# EAGLE design zik-pcb-base-bussed (EAGLE 6.5.0)
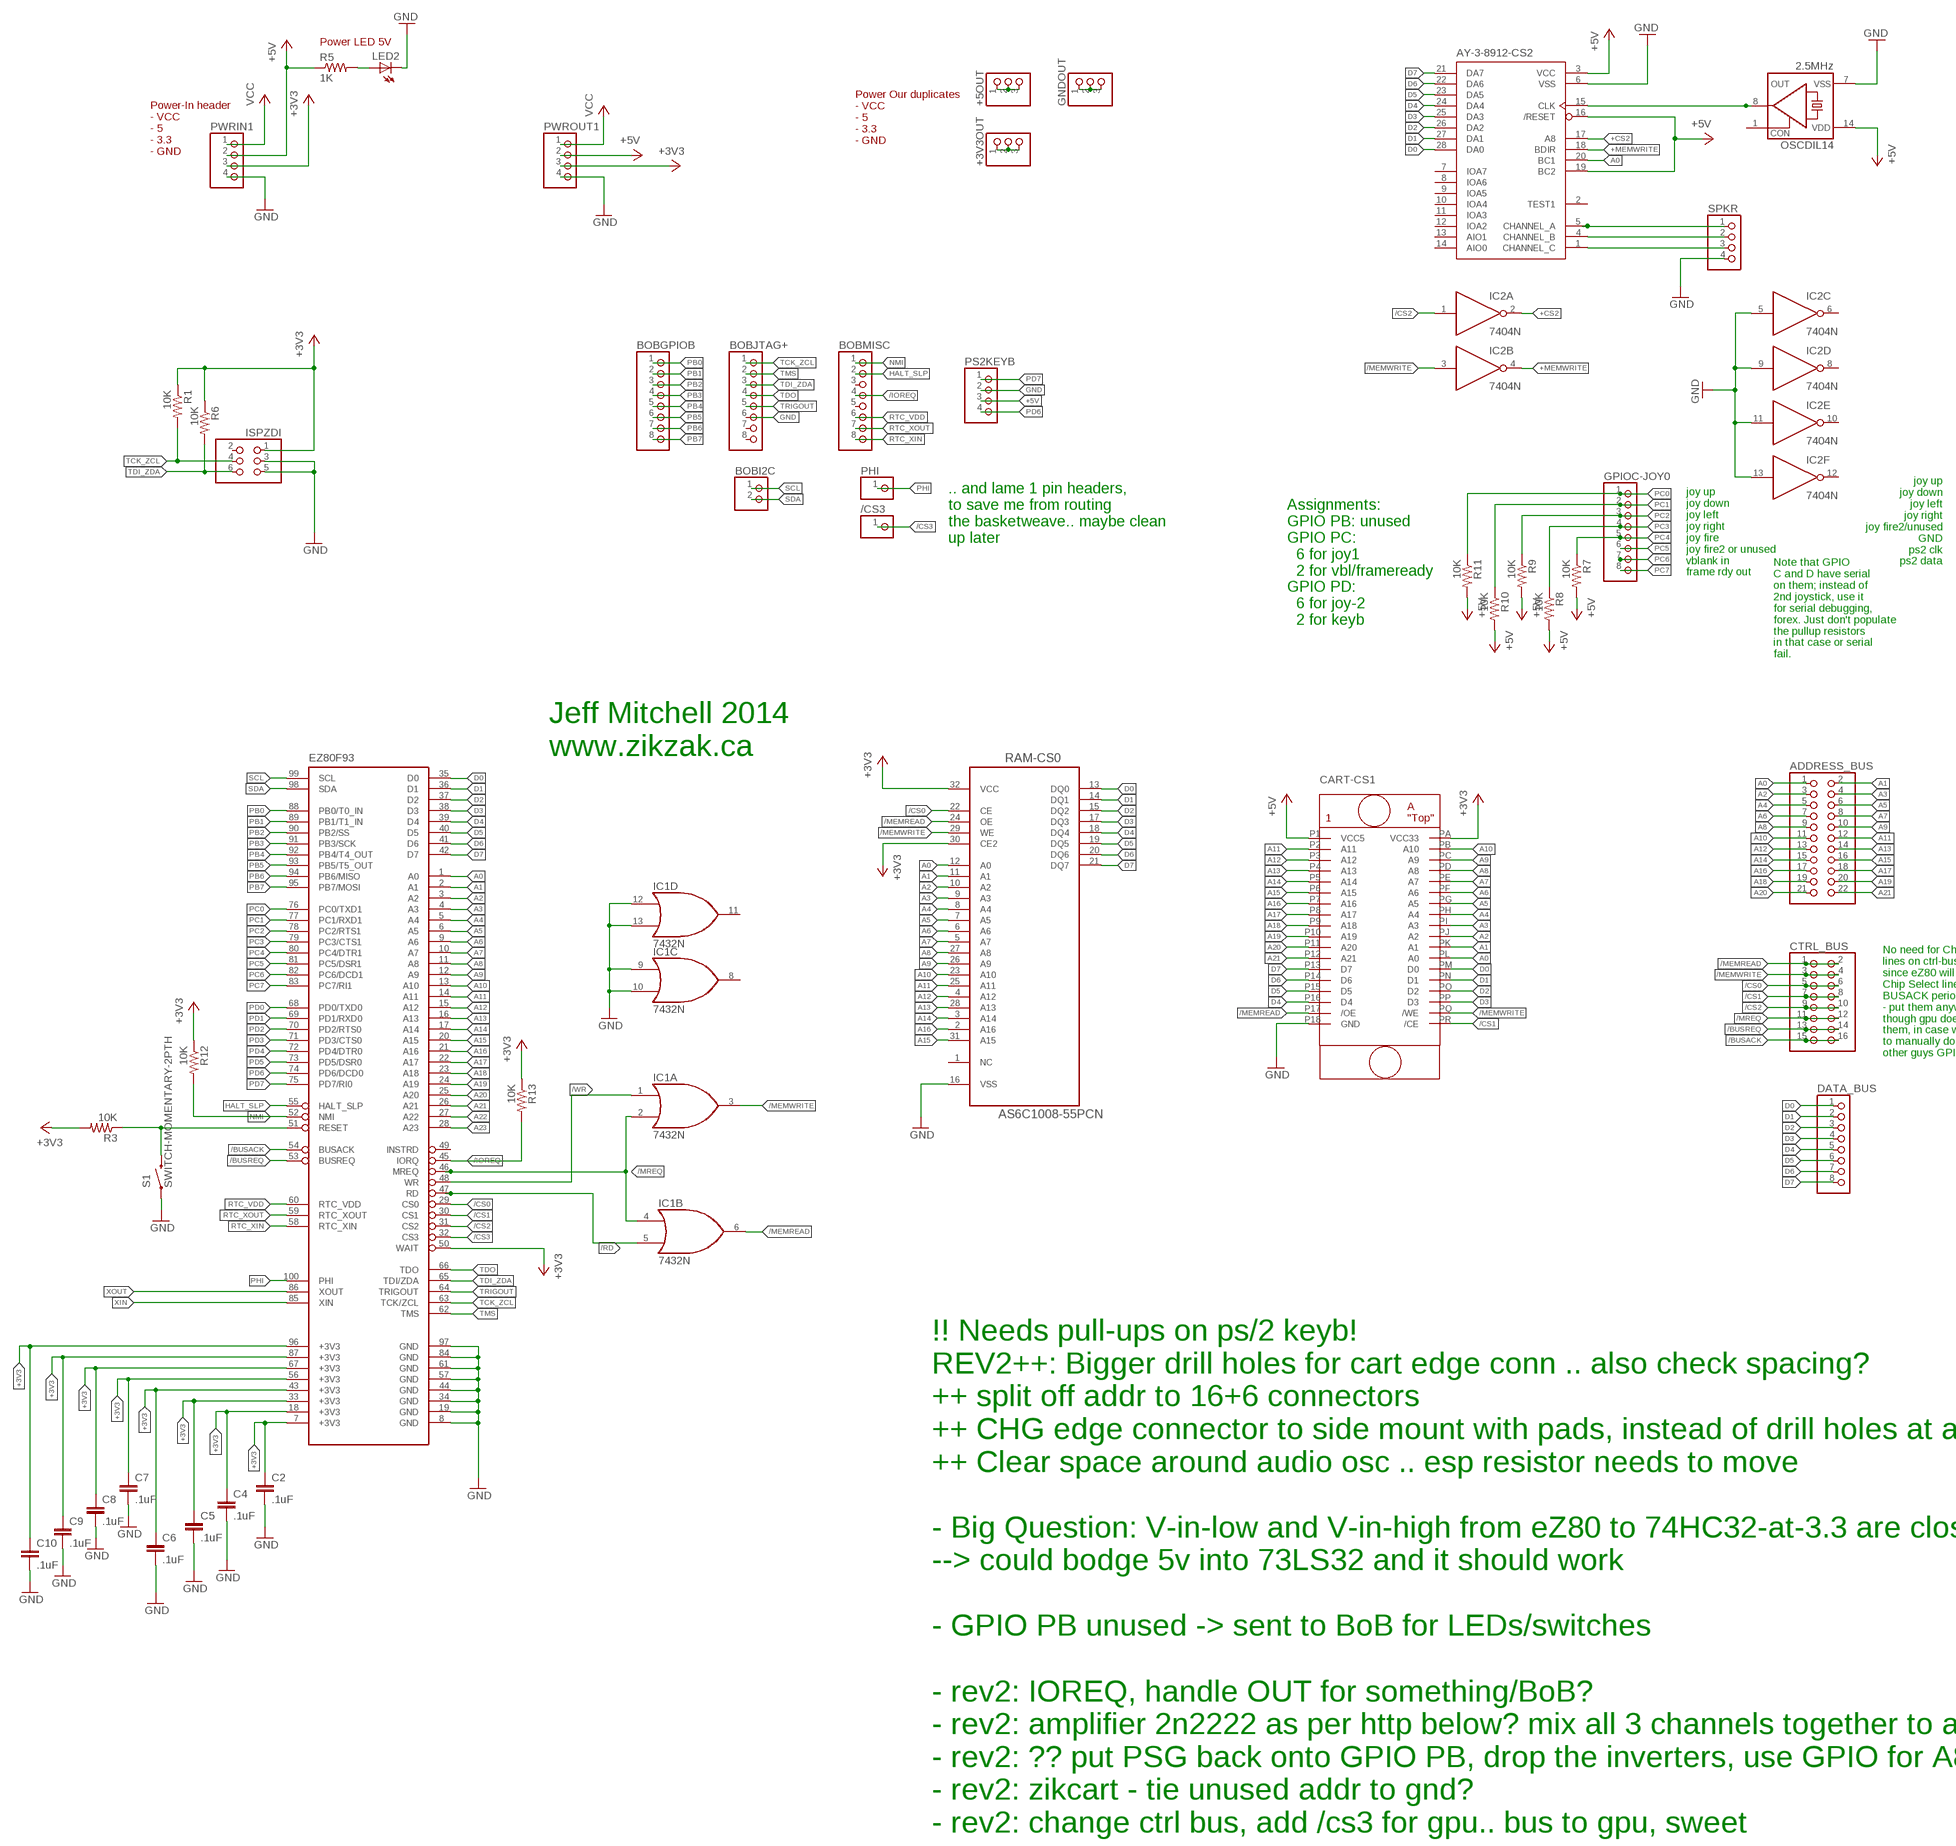
[diagram p0: schematic, sheet 1, part 1 of 2]
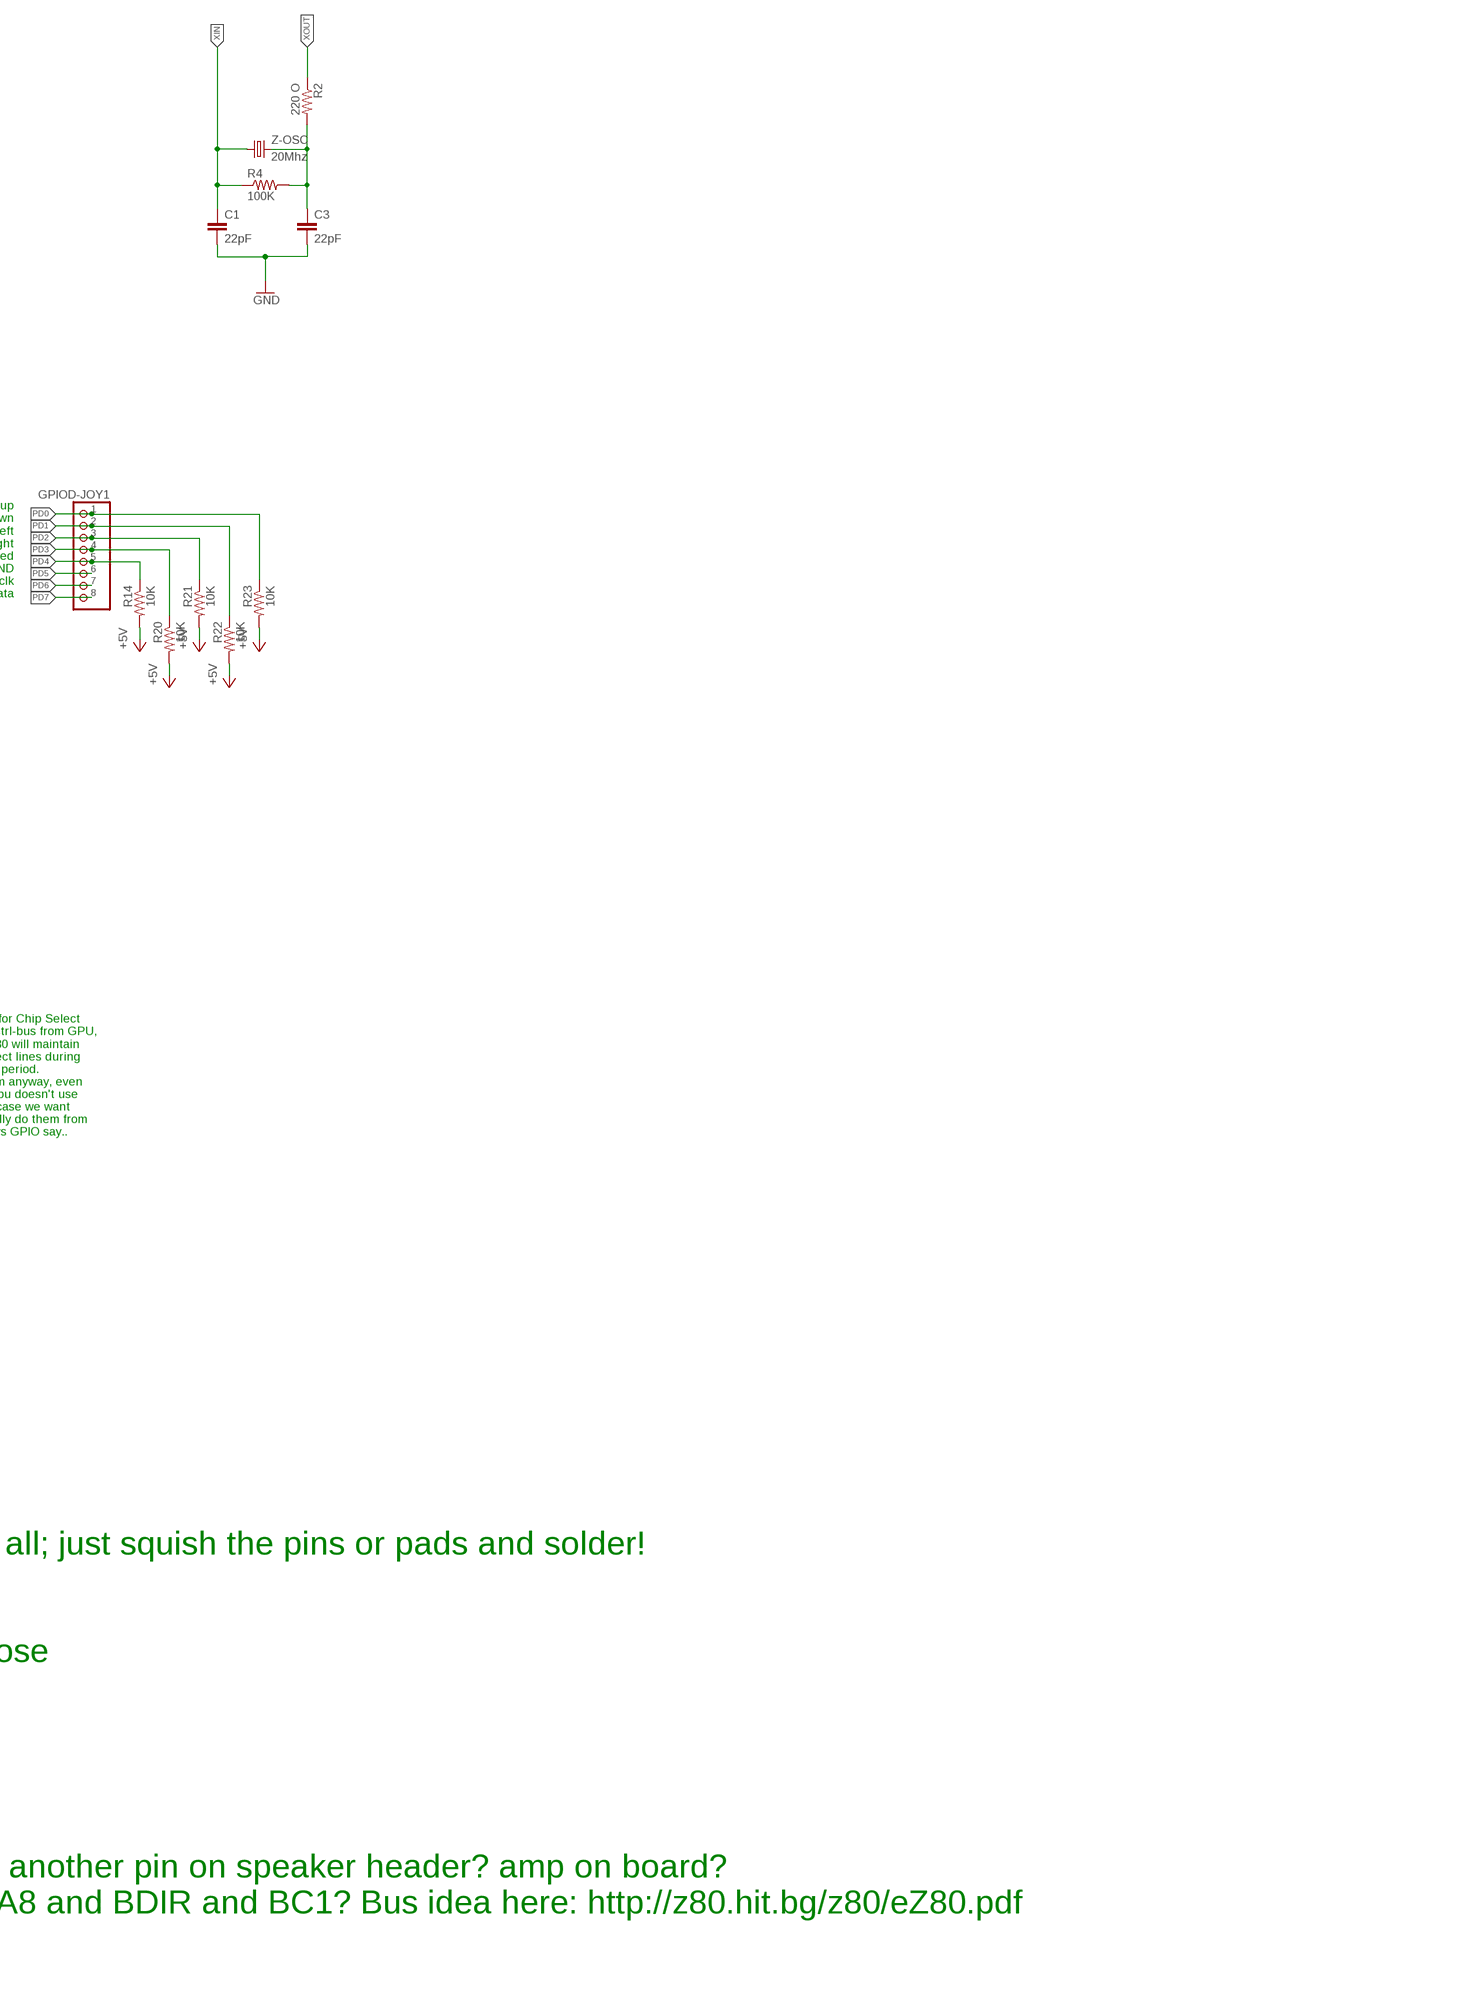
[diagram p1: schematic, sheet 1, part 2 of 2]

## Parts
+3V3OUT  PINHD-1X3  [1X03]
+5OUT  PINHD-1X3  [1X03]
/CS3  PINHD-1X1  [1X01]
ADDRESS_BUS  PINHD-2X11  [2X11]
AY-3-8912-CS2  AY-3-8912_28PIN  [DIL28]
BOBGPIOB  PINHD-1X8  [1X08]
BOBI2C  PINHD-1X2  [1X02]
BOBJTAG+  PINHD-1X8  [1X08]
BOBMISC  PINHD-1X8  [1X08]
C1  22pF  C-EU025-025X050  [C025-025X050]
C2  .1uF  C-EU025-025X050  [C025-025X050]
C3  22pF  C-EU025-025X050  [C025-025X050]
C4  .1uF  C-EU025-025X050  [C025-025X050]
C5  .1uF  C-EU025-025X050  [C025-025X050]
C6  .1uF  C-EU025-025X050  [C025-025X050]
C7  .1uF  C-EU025-025X050  [C025-025X050]
C8  .1uF  C-EU025-025X050  [C025-025X050]
C9  .1uF  C-EU025-025X050  [C025-025X050]
C10  .1uF  C-EU025-025X050  [C025-025X050]
CART-CS1  ZIKCART36  [ZIKCARTSLOT]
CTRL_BUS  PINHD-2X8  [2X08]
DATA_BUS  PINHD-1X8  [1X08]
EZ80F93  EZ80F92AZ  [SQFP-S-14X14-100]
GNDOUT  PINHD-1X3  [1X03]
GPIOC-JOY0  PINHD-1X8  [1X08]
GPIOD-JOY1  PINHD-1X8  [1X08]
IC1  7432N  [DIL14]
IC2  7404N  [DIL14]
ISPZDI  PINHD-2X3  [2X03]
LED2  LED5MM  [LED5MM]
OSCDIL14  2.5MHz  CRYSTAL_RES-SG51  [SG51]
PHI  PINHD-1X1  [1X01]
PS2KEYB  PINHD-1X4  [1X04]
PWRIN1  PINHD-1X4  [1X04]
PWROUT1  PINHD-1X4  [1X04]
R1  10K  R-US_0204/7  [0204/7]
R2  220 O  R-US_0204/7  [0204/7]
R3  10K  R-US_0204/7  [0204/7]
R4  100K  R-US_0204/7  [0204/7]
R5  1K  R-US_0207/10  [0207/10]
R6  10K  R-US_0204/7  [0204/7]
R7  10K  R-US_0204/7  [0204/7]
R8  10K  R-US_0204/7  [0204/7]
R9  10K  R-US_0204/7  [0204/7]
R10  10K  R-US_0204/7  [0204/7]
R11  10K  R-US_0204/7  [0204/7]
R12  10K  R-US_0204/7  [0204/7]
R13  10K  R-US_0204/7  [0204/7]
R14  10K  R-US_0204/7  [0204/7]
R20  10K  R-US_0204/7  [0204/7]
R21  10K  R-US_0204/7  [0204/7]
R22  10K  R-US_0204/7  [0204/7]
R23  10K  R-US_0204/7  [0204/7]
RAM-CS0  AS6C1008-55PCN  [DIP254P1524X393-32]
S1  SWITCH-MOMENTARY-2PTH  [TACTILE-PTH]
SPKR  PINHD-1X4  [1X04]
Z-OSC  20Mhz  CRYSTALHC49US  [HC49US]

## Nets
+3V3: +3V3OUT.1 +3V3OUT.2 +3V3OUT.3 C2.1 C4.1 C5.1 C6.1 C7.1 C8.1 C9.1 C10.1 CART-CS1.PA(VCC33) EZ80F93.7(+3V3) EZ80F93.18(+3V3) EZ80F93.33(+3V3) EZ80F93.43(+3V3) EZ80F93.50(WAIT) EZ80F93.56(+3V3) EZ80F93.67(+3V3) EZ80F93.87(+3V3) EZ80F93.96(+3V3) ISPZDI.1 PWRIN1.3 PWROUT1.3 R1.1 R3.2 R6.1 R12.1 R13.1 RAM-CS0.30(CE2) RAM-CS0.32(VCC)
+5V: +5OUT.1 +5OUT.2 +5OUT.3 AY-3-8912-CS2.3(VCC) AY-3-8912-CS2.16(/RESET) AY-3-8912-CS2.19(BC2) CART-CS1.P1(VCC5) OSCDIL14.14(VDD) PS2KEYB.3 PWRIN1.2 PWROUT1.2 R5.1 R7.2 R8.2 R9.2 R10.2 R11.2 R14.2 R20.2 R21.2 R22.2 R23.2
+CS2: AY-3-8912-CS2.17(A8) IC2.2(A:O)
+MEMWRITE: AY-3-8912-CS2.18(BDIR) IC2.4(B:O)
/BUSACK: CTRL_BUS.15 CTRL_BUS.16 EZ80F93.54(BUSACK)
/BUSREQ: CTRL_BUS.13 CTRL_BUS.14 EZ80F93.53(BUSREQ)
/CS0: CTRL_BUS.5 CTRL_BUS.6 EZ80F93.29(CS0) RAM-CS0.22(CE)
/CS1: CART-CS1.PR(/CE) CTRL_BUS.7 CTRL_BUS.8 EZ80F93.30(CS1)
/CS2: CTRL_BUS.9 CTRL_BUS.10 EZ80F93.31(CS2) IC2.1(A:I)
/CS3: /CS3.1 EZ80F93.32(CS3)
/IOREQ: BOBMISC.4 EZ80F93.45(IORQ) R13.2
/MEMREAD: CART-CS1.P17(/OE) CTRL_BUS.1 CTRL_BUS.2 IC1.6(B:O) RAM-CS0.24(OE)
/MEMWRITE: CART-CS1.PQ(/WE) CTRL_BUS.3 CTRL_BUS.4 IC1.3(A:O) IC2.3(B:I) RAM-CS0.29(WE)
/MREQ: CTRL_BUS.11 CTRL_BUS.12 EZ80F93.46(MREQ) IC1.2(A:I1) IC1.4(B:I0)
/RD: EZ80F93.47(RD) IC1.5(B:I1)
/WR: EZ80F93.48(WR) IC1.1(A:I0)
A0: ADDRESS_BUS.1 AY-3-8912-CS2.20(BC1) CART-CS1.PL(A0) EZ80F93.1(A0) RAM-CS0.12(A0)
A1: ADDRESS_BUS.2 CART-CS1.PK(A1) EZ80F93.2(A1) RAM-CS0.11(A1)
A2: ADDRESS_BUS.3 CART-CS1.PJ(A2) EZ80F93.3(A2) RAM-CS0.10(A2)
A3: ADDRESS_BUS.4 CART-CS1.PI(A3) EZ80F93.4(A3) RAM-CS0.9(A3)
A4: ADDRESS_BUS.5 CART-CS1.PH(A4) EZ80F93.5(A4) RAM-CS0.8(A4)
A5: ADDRESS_BUS.6 CART-CS1.PG(A5) EZ80F93.6(A5) RAM-CS0.7(A5)
A6: ADDRESS_BUS.7 CART-CS1.PF(A6) EZ80F93.9(A6) RAM-CS0.6(A6)
A7: ADDRESS_BUS.8 CART-CS1.PE(A7) EZ80F93.10(A7) RAM-CS0.5(A7)
A8: ADDRESS_BUS.9 CART-CS1.PD(A8) EZ80F93.11(A8) RAM-CS0.27(A8)
A9: ADDRESS_BUS.10 CART-CS1.PC(A9) EZ80F93.12(A9) RAM-CS0.26(A9)
A10: ADDRESS_BUS.11 CART-CS1.PB(A10) EZ80F93.13(A10) RAM-CS0.23(A10)
A11: ADDRESS_BUS.12 CART-CS1.P2(A11) EZ80F93.14(A11) RAM-CS0.25(A11)
A12: ADDRESS_BUS.13 CART-CS1.P3(A12) EZ80F93.15(A12) RAM-CS0.4(A12)
A13: ADDRESS_BUS.14 CART-CS1.P4(A13) EZ80F93.16(A13) RAM-CS0.28(A13)
A14: ADDRESS_BUS.15 CART-CS1.P5(A14) EZ80F93.17(A14) RAM-CS0.3(A14)
A15: ADDRESS_BUS.16 CART-CS1.P6(A15) EZ80F93.20(A15) RAM-CS0.31(A15)
A16: ADDRESS_BUS.17 CART-CS1.P7(A16) EZ80F93.21(A16) RAM-CS0.2(A16)
A17: ADDRESS_BUS.18 CART-CS1.P8(A17) EZ80F93.22(A17)
A18: ADDRESS_BUS.19 CART-CS1.P9(A18) EZ80F93.23(A18)
A19: ADDRESS_BUS.20 CART-CS1.P10(A19) EZ80F93.24(A19)
A20: ADDRESS_BUS.21 CART-CS1.P11(A20) EZ80F93.25(A20)
A21: ADDRESS_BUS.22 CART-CS1.P12(A21) EZ80F93.26(A21)
A22: EZ80F93.27(A22)
A23: EZ80F93.28(A23)
D0: AY-3-8912-CS2.28(DA0) CART-CS1.PM(D0) DATA_BUS.1 EZ80F93.35(D0) RAM-CS0.13(DQ0)
D1: AY-3-8912-CS2.27(DA1) CART-CS1.PN(D1) DATA_BUS.2 EZ80F93.36(D1) RAM-CS0.14(DQ1)
D2: AY-3-8912-CS2.26(DA2) CART-CS1.PO(D2) DATA_BUS.3 EZ80F93.37(D2) RAM-CS0.15(DQ2)
D3: AY-3-8912-CS2.25(DA3) CART-CS1.PP(D3) DATA_BUS.4 EZ80F93.38(D3) RAM-CS0.17(DQ3)
D4: AY-3-8912-CS2.24(DA4) CART-CS1.P16(D4) DATA_BUS.5 EZ80F93.39(D4) RAM-CS0.18(DQ4)
D5: AY-3-8912-CS2.23(DA5) CART-CS1.P15(D5) DATA_BUS.6 EZ80F93.40(D5) RAM-CS0.19(DQ5)
D6: AY-3-8912-CS2.22(DA6) CART-CS1.P14(D6) DATA_BUS.7 EZ80F93.41(D6) RAM-CS0.20(DQ6)
D7: AY-3-8912-CS2.21(DA7) CART-CS1.P13(D7) DATA_BUS.8 EZ80F93.42(D7) RAM-CS0.21(DQ7)
GND: AY-3-8912-CS2.6(VSS) C1.2 C2.2 C3.2 C4.2 C5.2 C6.2 C7.2 C8.2 C9.2 C10.2 CART-CS1.P18(GND) EZ80F93.8(GND) EZ80F93.19(GND) EZ80F93.34(GND) EZ80F93.44(GND) EZ80F93.57(GND) EZ80F93.61(GND) EZ80F93.84(GND) EZ80F93.97(GND) GNDOUT.1 GNDOUT.2 GNDOUT.3 IC1.9(C:I0) IC1.10(C:I1) IC1.12(D:I0) IC1.13(D:I1) IC2.5(C:I) IC2.9(D:I) IC2.11(E:I) IC2.13(F:I) ISPZDI.3 ISPZDI.5 LED2.K(C) OSCDIL14.7(VSS) PS2KEYB.2 PWRIN1.4 PWROUT1.4 RAM-CS0.16(VSS) S1.1 SPKR.4
HALT_SLP: BOBMISC.2 EZ80F93.55(HALT_SLP)
N$1: C3.1 R2.2 R4.2 Z-OSC.2
N$2: LED2.A R5.2
N$8: AY-3-8912-CS2.4(CHANNEL_B) SPKR.2
N$9: AY-3-8912-CS2.1(CHANNEL_C) SPKR.3
N$10: AY-3-8912-CS2.5(CHANNEL_A) SPKR.1
N$11: AY-3-8912-CS2.15(CLK) OSCDIL14.8(OUT)
NMI: BOBMISC.1 EZ80F93.52(NMI) R12.2
NRST: EZ80F93.51(RESET) R3.1 S1.3
PB0: BOBGPIOB.1 EZ80F93.88(PB0/T0_IN)
PB1: BOBGPIOB.2 EZ80F93.89(PB1/T1_IN)
PB2: BOBGPIOB.3 EZ80F93.90(PB2/SS)
PB3: BOBGPIOB.4 EZ80F93.91(PB3/SCK)
PB4: BOBGPIOB.5 EZ80F93.92(PB4/T4_OUT)
PB5: BOBGPIOB.6 EZ80F93.93(PB5/T5_OUT)
PB6: BOBGPIOB.7 EZ80F93.94(PB6/MISO)
PB7: BOBGPIOB.8 EZ80F93.95(PB7/MOSI)
PC0: EZ80F93.76(PC0/TXD1) GPIOC-JOY0.1 R11.1
PC1: EZ80F93.77(PC1/RXD1) GPIOC-JOY0.2 R10.1
PC2: EZ80F93.78(PC2/RTS1) GPIOC-JOY0.3 R9.1
PC3: EZ80F93.79(PC3/CTS1) GPIOC-JOY0.4 R8.1
PC4: EZ80F93.80(PC4/DTR1) GPIOC-JOY0.5 R7.1
PC5: EZ80F93.81(PC5/DSR1) GPIOC-JOY0.6
PC6: EZ80F93.82(PC6/DCD1) GPIOC-JOY0.7
PC7: EZ80F93.83(PC7/RI1) GPIOC-JOY0.8
PD0: EZ80F93.68(PD0/TXD0) GPIOD-JOY1.1 R23.1
PD1: EZ80F93.69(PD1/RXD0) GPIOD-JOY1.2 R22.1
PD2: EZ80F93.70(PD2/RTS0) GPIOD-JOY1.3 R21.1
PD3: EZ80F93.71(PD3/CTS0) GPIOD-JOY1.4 R20.1
PD4: EZ80F93.72(PD4/DTR0) GPIOD-JOY1.5 R14.1
PD5: EZ80F93.73(PD5/DSR0) GPIOD-JOY1.6
PD6: EZ80F93.74(PD6/DCD0) GPIOD-JOY1.7 PS2KEYB.4
PD7: EZ80F93.75(PD7/RI0) GPIOD-JOY1.8 PS2KEYB.1
PHI: EZ80F93.100(PHI) PHI.1
RTC_VDD: BOBMISC.6 EZ80F93.60(RTC_VDD)
RTC_XIN: BOBMISC.8 EZ80F93.58(RTC_XIN)
RTC_XOUT: BOBMISC.7 EZ80F93.59(RTC_XOUT)
SCL: BOBI2C.1 EZ80F93.99(SCL)
SDA: BOBI2C.2 EZ80F93.98(SDA)
TCK_ZCL: BOBJTAG+.1 EZ80F93.63(TCK/ZCL) ISPZDI.4 R1.2
TDI_ZDA: BOBJTAG+.3 EZ80F93.65(TDI/ZDA) ISPZDI.6 R6.2
TDO: BOBJTAG+.4 EZ80F93.66(TDO)
TMS: BOBJTAG+.2 EZ80F93.62(TMS)
TRIGOUT: BOBJTAG+.5 EZ80F93.64(TRIGOUT)
VCC: PWRIN1.1 PWROUT1.1
XIN: C1.1 EZ80F93.85(XIN) R4.1 Z-OSC.1
XOUT: EZ80F93.86(XOUT) R2.1
Unconnected: AY-3-8912-CS2.2(TEST1) AY-3-8912-CS2.7(IOA7) AY-3-8912-CS2.8(IOA6) AY-3-8912-CS2.9(IOA5) AY-3-8912-CS2.10(IOA4) AY-3-8912-CS2.11(IOA3) AY-3-8912-CS2.12(IOA2) AY-3-8912-CS2.13(AIO1) AY-3-8912-CS2.14(AIO0) BOBJTAG+.6 BOBJTAG+.7 BOBJTAG+.8 BOBMISC.3 BOBMISC.5 EZ80F93.49(INSTRD) IC1.8(C:O) IC1.11(D:O) IC2.6(C:O) IC2.8(D:O) IC2.10(E:O) IC2.12(F:O) ISPZDI.2 OSCDIL14.1(CON) RAM-CS0.1(NC)

## Notes on the sheet
- Power LED 5V
- Power Our duplicates
  - VCC
  - 5
  - 3.3
  - GND
- Power-In header
  - VCC
  - 5
  - 3.3
  - GND
- .. and lame 1 pin headers,
  to save me from routing
  the basketweave.. maybe clean
  up later
- joy up
  joy down
  joy left
  joy right
  joy fire2/unused
  GND
  ps2 clk
  ps2 data
- joy up
  joy down
  joy left
  joy right
  joy fire
  joy fire2 or unused
  vblank in
  frame rdy out
- Assignments:
  GPIO PB: unused
  GPIO PC:
    6 for joy1
    2 for vbl/frameready
  GPIO PD:
    6 for joy-2
    2 for keyb
- Note that GPIO
  C and D have serial
  on them; instead of
  2nd joystick, use it
  for serial debugging,
  forex. Just don't populate
  the pullup resistors
  in that case or serial
  fail.
- Jeff Mitchell 2014
  www.zikzak.ca
- No need for Chip Select
  lines on ctrl-bus from GPU,
  since eZ80 will maintain
  Chip Select lines during
  BUSACK period.
  - put them anyway, even
  though gpu doesn't use
  them, in case we want
  to manually do them from
  other guys GPIO say..
- !! Needs pull-ups on ps/2 keyb!
  REV2++: Bigger drill holes for cart edge conn .. also check spacing?
  ++ split off addr to 16+6 connectors
  ++ CHG edge connector to side mount with pads, instead of drill holes at all; just squish the pins or pads and solder!
  ++ Clear space around audio osc .. esp resistor needs to move
  
  - Big Question: V-in-low and V-in-high from eZ80 to 74HC32-at-3.3 are close
  --> could bodge 5v into 73LS32 and it should work
  
  - GPIO PB unused -> sent to BoB for LEDs/switches
  
  - rev2: IOREQ, handle OUT for something/BoB?
  - rev2: amplifier 2n2222 as per http below? mix all 3 channels together to another pin on speaker header? amp on board?
  - rev2: ?? put PSG back onto GPIO PB, drop the inverters, use GPIO for A8 and BDIR and BC1? Bus idea here: http://z80.hit.bg/z80/eZ80.pdf
  - rev2: zikcart - tie unused addr to gnd?
  - rev2: change ctrl bus, add /cs3 for gpu.. bus to gpu, sweet

## Power pins joined to a net without a drawn wire
+3V3: IC1.14(P:+3V3)
+5V: IC2.14(P:+5V)
GND: IC1.7(P:GND) IC2.7(P:GND)

## Library data of the parts
+3V3OUT +5OUT GNDOUT = pinhead:PINHD-1X3: PIN HEADER
/CS3 PHI = pinhead:PINHD-1X1: PIN HEADER
ADDRESS_BUS = pinhead:PINHD-2X11: PIN HEADER
AY-3-8912-CS2 = 8Bit_Parts:AY-3-8912_28PIN
BOBGPIOB BOBJTAG+ BOBMISC DATA_BUS GPIOC-JOY0 GPIOD-JOY1 = pinhead:PINHD-1X8: PIN HEADER
BOBI2C = pinhead:PINHD-1X2: PIN HEADER
C1-C10 = rcl:C-EU: CAPACITOR, European symbol
CART-CS1 = skeezix:ZIKCART36
CTRL_BUS = pinhead:PINHD-2X8: PIN HEADER
EZ80F93 = Zilog-eZ80-v1_0:EZ80F92: eZ80L92/F92/F93 Identical pinouts for all.
IC1 = 74xx-us-33v-skeezix:74*32: Quad 2-input OR gate
IC2 = 74xx-us-5v-skeezix:74*04: Hex INVERTER
ISPZDI = pinhead:PINHD-2X3: PIN HEADER
LED2 = SparkFun-LED:LED: LEDs Standard schematic elements and footprints for 5mm, 3mm, 1206, and 0603 sized LEDs. 5mm - Spark Fun Electronics SKU : COM-00529 (and others)
OSCDIL14 = crystal:CRYSTAL_RES-: CRYSTAL RESONATOR; OC_FARNELL: unknown; OC_NEWARK: unknown
PS2KEYB PWRIN1 PWROUT1 SPKR = pinhead:PINHD-1X4: PIN HEADER
R1-R14 R20-R23 = rcl:R-US_: RESISTOR, American symbol
RAM-CS0 = Alliance_Memory_By_element14_Batch_1:AS6C1008-55PCN: CMOS SRAM; MPN: AS6C1008-55PCN; OC_FARNELL: 1562896; OC_NEWARK: 94M6214; PACKAGE: DIP-32; SUPPLIER: ALLIANCE MEMORY
S1 = SparkFun-Electromechanical:SWITCH-MOMENTARY-2: Various NO switches- pushbuttons, reed, etc
Z-OSC = SparkFun-FreqCtrl:CRYSTAL: Various standard crystals. Proven footprints. Spark Fun Electronics SKU : COM-00534

## Net classes
1 power: width 0.254 mm

## Board
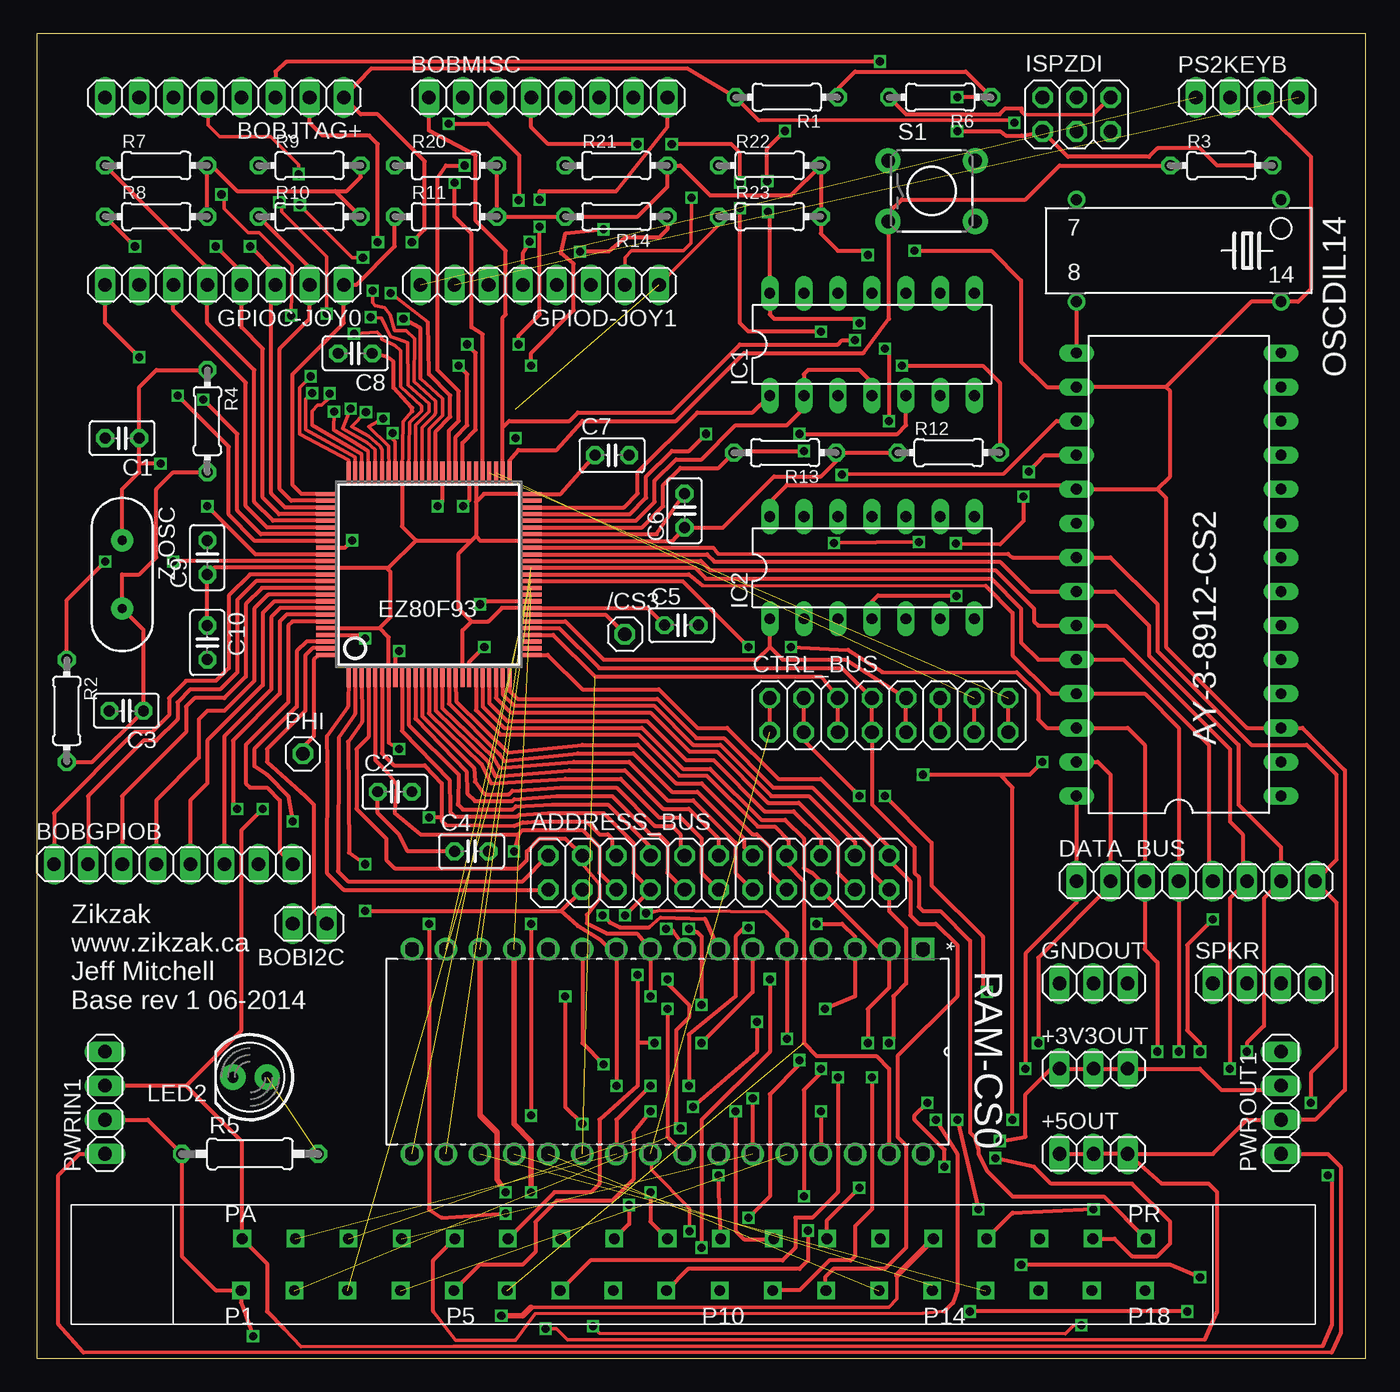
[diagram p2: board, top side]
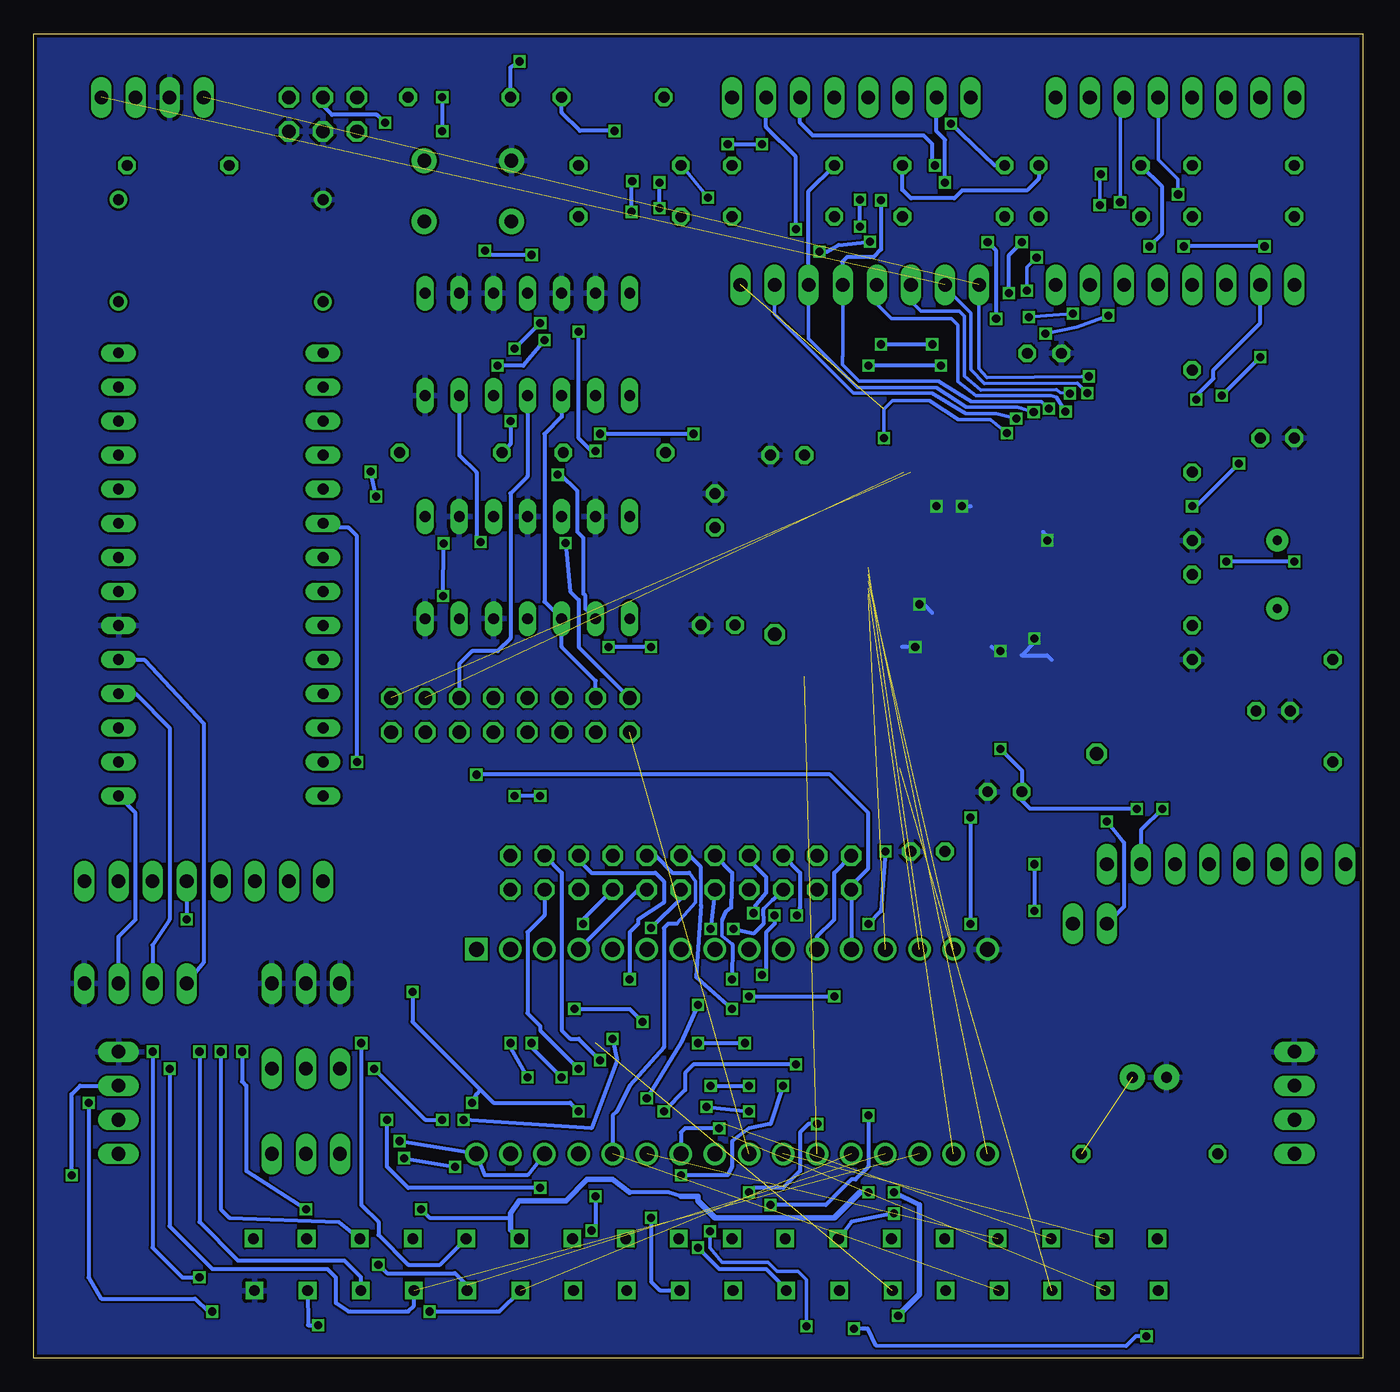
[diagram p3: board, bottom side, seen from below]

Size 99.04 x 98.73 mm. Coordinates in mm from the lower left corner, seen from the top.
Outline: 0,0 99.04,0 99.04,98.73 0,98.73 0,0
Copper layers (1*16): Top 0.035mm / dielectric 1.5mm / Bottom 0.035mm
Design rules "Elecrow_2-layer_eagle_rule": minimum track width 6mil, minimum drill 12mil, track to track 6mil, track to pad 6mil, pad to pad 6mil, via to via 6mil, smd to smd 0mil, copper to edge 10mil, drill to drill 10mil, minimum pad ring 10mil, minimum via ring 6mil, stop-mask expansion 2mil, vias tented up to drill 100mil, thermal gap 10mil

### Footprints (pad centres in the part's own frame; a part is rotated, then mirrored left to right if it is on the bottom)
1X03 = drill 1.016 long: 1 -2.54,0; 2 0,0; 3 2.54,0
1X01 = drill 1.016 octagon: 1 0,0
2X11 = drill 1.016 octagon: 1 -12.7,-1.27; 2 -12.7,1.27; 3 -10.16,-1.27; 4 -10.16,1.27; 5 -7.62,-1.27; 6 -7.62,1.27; 7 -5.08,-1.27; 8 -5.08,1.27; 9 -2.54,-1.27; 10 -2.54,1.27; 11 0,-1.27; 12 0,1.27; 13 2.54,-1.27; 14 2.54,1.27; 15 5.08,-1.27; 16 5.08,1.27; 17 7.62,-1.27; 18 7.62,1.27; 19 10.16,-1.27; 20 10.16,1.27; 21 12.7,-1.27; 22 12.7,1.27
DIL28 = drill 0.813 long: 1 -16.51,-7.62; 2 -13.97,-7.62; 3 -11.43,-7.62; 4 -8.89,-7.62; 5 -6.35,-7.62; 6 -3.81,-7.62; 7 -1.27,-7.62; 8 1.27,-7.62; 9 3.81,-7.62; 10 6.35,-7.62; 11 8.89,-7.62; 12 11.43,-7.62; 13 13.97,-7.62; 14 16.51,-7.62; 15 16.51,7.62; 16 13.97,7.62; 17 11.43,7.62; 18 8.89,7.62; 19 6.35,7.62; 20 3.81,7.62; 21 1.27,7.62; 22 -1.27,7.62; 23 -3.81,7.62; 24 -6.35,7.62; 25 -8.89,7.62; 26 -11.43,7.62; 27 -13.97,7.62; 28 -16.51,7.62
1X08 = drill 1.016 long: 1 -8.89,0; 2 -6.35,0; 3 -3.81,0; 4 -1.27,0; 5 1.27,0; 6 3.81,0; 7 6.35,0; 8 8.89,0
1X02 = drill 1.016 long: 1 -1.27,0; 2 1.27,0
C025-025X050 = drill 0.813 octagon: 1 -1.27,0; 2 1.27,0
ZIKCARTSLOT = drill 0.8 square: P1 12.675,2.515; P2 16.637,2.515; P3 20.599,2.515; P4 24.562,2.515; P5 28.524,2.515; P6 32.487,2.515; P7 36.449,2.515; P8 40.411,2.515; P9 44.374,2.515; P10 48.336,2.515; P11 52.299,2.515; P12 56.261,2.515; P13 60.223,2.515; P14 64.186,2.515; P15 68.148,2.515; P16 72.111,2.515; P17 76.073,2.515; P18 80.035,2.515; PA 12.751,6.375; PB 16.713,6.375; PC 20.676,6.375; PD 24.638,6.375; PE 28.6,6.375; PF 32.563,6.375; PG 36.525,6.375; PH 40.488,6.375; PI 44.45,6.375; PJ 48.412,6.375; PK 52.375,6.375; PL 56.337,6.375; PM 60.3,6.375; PN 64.262,6.375; PO 68.224,6.375; PP 72.187,6.375; PQ 76.149,6.375; PR 80.112,6.375
2X08 = drill 1.016 octagon: 1 -8.89,-1.27; 2 -8.89,1.27; 3 -6.35,-1.27; 4 -6.35,1.27; 5 -3.81,-1.27; 6 -3.81,1.27; 7 -1.27,-1.27; 8 -1.27,1.27; 9 1.27,-1.27; 10 1.27,1.27; 11 3.81,-1.27; 12 3.81,1.27; 13 6.35,-1.27; 14 6.35,1.27; 15 8.89,-1.27; 16 8.89,1.27
SQFP-S-14X14-100 = smd 0.3 x 1.6: 1 -6,-7.6; 2 -5.5,-7.6; 3 -5,-7.6; 4 -4.5,-7.6; 5 -4,-7.6; 6 -3.5,-7.6; 7 -3,-7.6; 8 -2.5,-7.6; 9 -2,-7.6; 10 -1.5,-7.6; 11 -1,-7.6; 12 -0.5,-7.6; 13 0,-7.6; 14 0.5,-7.6; 15 1,-7.6; 16 1.5,-7.6; 17 2,-7.6; 18 2.5,-7.6; 19 3,-7.6; 20 3.5,-7.6; 21 4,-7.6; 22 4.5,-7.6; 23 5,-7.6; 24 5.5,-7.6; 25 6,-7.6; 51 6,7.6; 52 5.5,7.6; 53 5,7.6; 54 4.5,7.6; 55 4,7.6; 56 3.5,7.6; 57 3,7.6; 58 2.5,7.6; 59 2,7.6; 60 1.5,7.6; 61 1,7.6; 62 0.5,7.6; 63 0,7.6; 64 -0.5,7.6; 65 -1,7.6; 66 -1.5,7.6; 67 -2,7.6; 68 -2.5,7.6; 69 -3,7.6; 70 -3.5,7.6; 71 -4,7.6; 72 -4.5,7.6; 73 -5,7.6; 74 -5.5,7.6; 75 -6,7.6 | smd 1.6 x 0.3: 26 7.6,-6; 27 7.6,-5.5; 28 7.6,-5; 29 7.6,-4.5; 30 7.6,-4; 31 7.6,-3.5; 32 7.6,-3; 33 7.6,-2.5; 34 7.6,-2; 35 7.6,-1.5; 36 7.6,-1; 37 7.6,-0.5; 38 7.6,0; 39 7.6,0.5; 40 7.6,1; 41 7.6,1.5; 42 7.6,2; 43 7.6,2.5; 44 7.6,3; 45 7.6,3.5; 46 7.6,4; 47 7.6,4.5; 48 7.6,5; 49 7.6,5.5; 50 7.6,6; 76 -7.6,6; 77 -7.6,5.5; 78 -7.6,5; 79 -7.6,4.5; 80 -7.6,4; 81 -7.6,3.5; 82 -7.6,3; 83 -7.6,2.5; 84 -7.6,2; 85 -7.6,1.5; 86 -7.6,1; 87 -7.6,0.5; 88 -7.6,0; 89 -7.6,-0.5; 90 -7.6,-1; 91 -7.6,-1.5; 92 -7.6,-2; 93 -7.6,-2.5; 94 -7.6,-3; 95 -7.6,-3.5; 96 -7.6,-4; 97 -7.6,-4.5; 98 -7.6,-5; 99 -7.6,-5.5; 100 -7.6,-6
DIL14 = drill 0.813 long: 1 -7.62,-3.81; 2 -5.08,-3.81; 3 -2.54,-3.81; 4 0,-3.81; 5 2.54,-3.81; 6 5.08,-3.81; 7 7.62,-3.81; 8 7.62,3.81; 9 5.08,3.81; 10 2.54,3.81; 11 0,3.81; 12 -2.54,3.81; 13 -5.08,3.81; 14 -7.62,3.81
2X03 = drill 1.016 octagon: 1 -2.54,-1.27; 2 -2.54,1.27; 3 0,-1.27; 4 0,1.27; 5 2.54,-1.27; 6 2.54,1.27
LED5MM = drill 0.813 pad 1.88: A -1.27,0; K 1.27,0
SG51 = drill 0.813: 1 -7.62,-3.81; 7 7.62,-3.81; 8 7.62,3.81; 14 -7.62,3.81
1X04 = drill 1.016 long: 1 -3.81,0; 2 -1.27,0; 3 1.27,0; 4 3.81,0
0204/7 = drill 0.813 octagon: 1 -3.81,0; 2 3.81,0
0207/10 = drill 0.813 octagon: 1 -5.08,0; 2 5.08,0
DIP254P1524X393-32 = drill 1.118 square: 1 -15.24,38.1 | drill 1.118: 2 -15.24,35.56; 3 -15.24,33.02; 4 -15.24,30.48; 5 -15.24,27.94; 6 -15.24,25.4; 7 -15.24,22.86; 8 -15.24,20.32; 9 -15.24,17.78; 10 -15.24,15.24; 11 -15.24,12.7; 12 -15.24,10.16; 13 -15.24,7.62; 14 -15.24,5.08; 15 -15.24,2.54; 16 -15.24,0; 17 0,0; 18 0,2.54; 19 0,5.08; 20 0,7.62; 21 0,10.16; 22 0,12.7; 23 0,15.24; 24 0,17.78; 25 0,20.32; 26 0,22.86; 27 0,25.4; 28 0,27.94; 29 0,30.48; 30 0,33.02; 31 0,35.56; 32 0,38.1
TACTILE-PTH = drill 1.016 pad 1.88: 1 -3.251,2.261; 2 3.251,2.261; 3 -3.251,-2.261; 4 3.251,-2.261
HC49US = drill 0.7 pad 1.651: 1 -2.54,0; 2 2.54,0

### Placement (x,y rotation side)
+3V3OUT  78.74,21.59 0 top
+5OUT  78.74,15.24 0 top
/CS3  43.81,53.98 0 top
ADDRESS_BUS  50.8,36.2 0 top
AY-3-8912-CS2  85.09,58.42 90 top
BOBGPIOB  10.16,36.83 0 top
BOBI2C  20.32,32.38 180 top
BOBJTAG+  13.97,93.98 180 top
BOBMISC  38.1,93.98 0 top
C1  6.35,68.58 180 top
C2  26.67,42.23 0 top
C3  6.67,48.26 180 top
C4  32.38,37.78 0 top
C5  48.04,54.64 0 top
C6  48.26,63.18 90 top
C7  42.86,67.31 0 top
C8  23.72,74.9 180 top
C9  12.7,59.69 90 top
C10  12.7,53.34 270 top
CART-CS1  2.54,2.54 0 top
CTRL_BUS  63.5,47.94 0 top
DATA_BUS  86.36,35.56 0 top
EZ80F93  29.21,58.42 0 top
GNDOUT  78.74,27.94 0 top
GPIOC-JOY0  13.97,80.01 180 top
GPIOD-JOY1  37.47,80.01 180 top
IC1  62.23,75.56 0 top
IC2  62.23,58.93 0 top
ISPZDI  77.47,92.71 0 top
LED2  15.88,20.95 180 top
OSCDIL14  85.09,82.55 180 top
PHI  19.81,45.05 0 top
PS2KEYB  90.17,93.98 0 top
PWRIN1  5.08,19.05 90 top
PWROUT1  92.71,19.05 90 top
R1  55.88,93.98 180 top
R2  2.22,48.26 270 top
R3  88.27,88.9 0 top
R4  12.7,69.85 270 top
R5  15.88,15.24 0 top
R6  67.31,93.98 180 top
R7  8.89,88.9 0 top
R8  8.89,85.09 0 top
R9  20.32,88.9 0 top
R10  20.32,85.09 0 top
R11  30.48,85.09 0 top
R12  67.94,67.5 0 top
R13  55.75,67.5 180 top
R14  43.18,85.09 180 top
R20  30.48,88.9 0 top
R21  43.18,88.9 0 top
R22  54.61,88.9 0 top
R23  54.61,85.09 0 top
RAM-CS0  27.94,15.24 270 top
S1  66.67,87 0 top
SPKR  91.44,27.94 0 top
Z-OSC  6.35,58.42 270 top

### Tracks (layer width: path | path; a pad name or v marks a point on that pad's centre or on a via)
+3V3  (via drill 0.6)
  Top 0.254: EZ80F93.67 27.27,69.82 27.97,70.58 | 18.41,2.22 19.68,0.86 31.05,0.89 95.82,0.92
  Top 0.305: C7.1 39.02,64.42 EZ80F93.50 33.31,64.42 32.71,63.82 | 27.97,70.58 27.97,70.83 26.57,72.33 26.57,74.26 26.13,74.61 C8.1 | EZ80F93.56 32.71,63.82 | 32.71,63.82 32.71,61.27 | 32.71,61.27 33.06,60.92 EZ80F93.43 47.35,60.92 C6.1 51.12,61.91 54.93,65.72 58.42,65.72 59.56,66.86 R13.1 R12.1 | C10.1 C9.1 13.2,58.92 EZ80F93.87 26.04,58.92 | 11.11,20.32 15.29,16.14 CART-CS1.PA 17.14,7.06 17.14,3.49 18.41,2.22 | 11.11,20.32 PWRIN1.3 | 11.11,20.32 15.24,24.45 15.24,39.37 v16.83,40.96 | 31.7,50.83 EZ80F93.18 31.71,54.25 32.38,54.93 | C4.1 27.62,37.78 26.99,39.05 25.4,40.64 C2.1 | EZ80F93.67 27.21,62.01 28.26,60.96 | 28.26,60.96 32.4,60.96 | 32.4,60.96 32.71,61.27 | 32.38,54.93 33.66,54.93 34.65,55.92 EZ80F93.33 45.49,55.92 C5.1 | 26.04,58.92 26.22,58.92 28.26,60.96 | EZ80F93.96 25.53,54.42 | 25.53,54.42 26.35,55.24 26.35,58.6 26.04,58.92 | 25.53,54.42 26.21,53.74 EZ80F93.7 26.21,45.86 v26.99,45.4 | 32.38,54.93 31.43,55.88 31.43,59.99 32.4,60.96 | R1.1 59.69,94.61 60.96,95.89 69.22,95.89 R6.1 v68.58,93.98 | v68.58,91.44 71.79,91.44 72.2,91.12 73.37,91.12 73.41,91.09 ISPZDI.1 76.83,89.53 82.87,89.53 83.5,90.17 86.68,90.17 87.95,88.9 R3.2 | PWROUT1.3 92.39,20 88.27,20 86.68,21.59 +3V3OUT.3 +3V3OUT.2 +3V3OUT.1 75.56,21.59 73.66,19.68 73.66,16.51 v71.75,16.19 | 95.82,0.92 96.52,2.54 96.52,13.34 v96.2,13.65 | v54.48,85.44 54.61,85.31 IC1.14 54.61,77.79 54.93,77.47 60.96,77.47 v61.28,77.15 | v54.42,87.72 54.42,90.14 v55.75,91.47 | v63.18,75.25 63.5,74.93 v63.5,69.85
  Bottom 0.305: v16.83,40.96 24.77,40.96 25.4,41.59 C2.1 25.4,43.81 v26.99,45.4 | v68.58,93.98 v68.58,91.44 | RAM-CS0.30 62.23,13.65 65.41,13.65 RAM-CS0.32 v71.75,16.19 | v96.2,13.65 96.2,19.68 95.57,20.32 PWROUT1.3 | v54.48,85.44 54.48,87.66 v54.42,87.72 | v55.75,91.47 58.33,91.47 59.69,92.84 R1.1 | v61.28,77.15 v63.18,75.25 | v63.5,69.85 63.5,68.14 R12.1
+5V  (via drill 0.6)
  Top 0.254: v37.91,2.22 38.7,2.22 39.53,1.4 87.03,1.4
  Top 0.305: R8.2 R7.2 13.02,88.9 14.92,87 22.23,87 | 22.23,87 R10.2 | R20.2 R11.2 R14.2 44.77,85.09 46.99,87.31 R21.2 47.94,88.9 50.16,86.68 56.2,86.68 R22.2 R23.2 58.42,83.82 59.69,82.55 61.59,82.55 v61.91,82.23 | PS2KEYB.3 91.44,93.03 94.93,89.53 94.93,79.69 93.98,78.74 OSCDIL14.14 90.49,78.74 84.14,72.39 | 84.14,72.39 AY-3-8912-CS2.16 75.25,72.39 73.34,74.3 73.34,80.33 71.12,82.55 v65.41,82.55 | 83.5,64.77 84.14,64.14 84.14,53.02 90.17,46.99 AY-3-8912-CS2.3 94.3,46.99 97.47,43.81 97.47,20 95.25,17.78 PWROUT1.2 90.17,17.78 87.63,15.24 +5OUT.3 | 83.5,64.77 AY-3-8912-CS2.19 77.15,65.09 55.88,65.09 54.61,63.82 IC2.14 | 83.5,64.77 84.45,65.72 84.45,72.07 84.14,72.39 | +5OUT.3 +5OUT.2 +5OUT.1 | PWRIN1.2 8.26,17.78 R5.1 10.79,7.62 13.34,5.08 15.19,5.08 CART-CS1.P1 15.21,4.15 v16.1,1.65 | +5OUT.3 83.82,13.02 87.31,13.02 87.95,12.38 87.95,3.49 87.03,1.4 | 22.23,87 23.08,87 24.13,88.04 R9.2
  Bottom 0.305: v61.91,82.23 65.09,82.23 v65.41,82.55 | v16.1,1.65 16.89,1.65 17.62,0.92 36.26,0.95 36.86,2.22 v37.91,2.22 | R9.2 24.13,87.92 25.02,87.03 29.84,87.03 30.42,86.45 33.66,86.45 34.29,87.09 R20.2
+CS2  (via drill 0.6)
  Top 0.305: v59.98,65.85 60.33,65.91 72.07,65.94 75.98,69.85 AY-3-8912-CS2.17
  Bottom 0.305: IC2.2 57.91,55.88 57.91,56.83 58.07,56.99 58.07,61.15 58.52,61.59 58.52,64.64 59.75,65.88 v59.98,65.85
+MEMWRITE  (via drill 0.6)
  Top 0.305: IC2.4 62.23,56.42 62.67,56.86 68.48,56.86 v68.52,56.8 | v68.48,60.74 71.79,60.67 73.53,62.42 73.53,64.2 v73.5,64.23 | v73.91,66.07 75.09,67.31 AY-3-8912-CS2.18
  Bottom 0.305: v68.52,56.8 v68.48,60.74 | v73.5,64.23 73.85,65.79 v73.91,66.07
/BUSACK  (1 unrouted)
  Top 0.305: CTRL_BUS.15 CTRL_BUS.16
/BUSREQ  (1 unrouted)
  Top 0.305: CTRL_BUS.13 CTRL_BUS.14
/CS0  (1 unrouted)
  Top 0.305: CTRL_BUS.5 CTRL_BUS.6 58.42,50.8 41.59,50.8 38.47,53.92 EZ80F93.29
/CS1
  Top 0.305: EZ80F93.30 38.92,54.42 41.91,51.44 60.01,51.44 CTRL_BUS.8 CTRL_BUS.7 62.23,41.27 65.41,38.1 65.41,36.2 65.72,35.88 65.72,33.66 66.04,33.34 67.31,33.34 69.53,31.11 69.53,16.83 69.85,16.51 70.17,15.56 70.17,15.24 70.8,13.97 72.71,12.06 79.5,12.06 CART-CS1.PR
/CS2
  Top 0.305: CTRL_BUS.9 CTRL_BUS.10 60.26,52.07 55.56,52.07 54.61,53.02 | EZ80F93.31 39.38,54.92 42.23,52.07 53.66,52.07 54.61,53.02 | 54.61,53.02 IC2.1
/CS3
  Top 0.305: EZ80F93.32 42.37,55.42 /CS3.1
/IOREQ  (via drill 0.6)
  Top 0.305: EZ80F93.45 45.09,61.92 46.67,63.5 46.67,65.09 47.94,66.36 50.8,66.36 R13.2 52.07,67.63 v57.15,67.63 | v58.42,76.52 53.02,76.52 52.39,77.15 v52.39,85.72 | v52.39,87.63 52.39,89.85 51.75,90.49 v47.31,90.49 | v44.77,90.49 38.1,90.49 36.83,91.76 BOBMISC.4
  Bottom 0.305: v57.15,67.63 57.47,67.63 58.42,68.58 v58.42,76.52 | v52.39,85.72 v52.39,87.63 | v47.31,90.49 v44.77,90.49
/MEMREAD  (via drill 0.6)  (1 unrouted)
  Top 0.254: v77.82,2.48 77.28,2.48 76.64,1.84 41.94,1.87 v41.43,2.38 | v48.64,9.46 48.64,11.18 45.78,14.03 45.78,15.18 RAM-CS0.24
  Top 0.305: CTRL_BUS.1 CTRL_BUS.2 | v65.72,60.83 v59.4,60.77
  Bottom 0.254: v41.43,2.38 41.43,5.84 42.07,6.48 43.62,6.48 44.32,7.18 47.72,7.18 48.64,8.26 v48.64,9.46
  Bottom 0.305: CART-CS1.P17 78.58,2.48 v77.82,2.48 | IC1.6 67.31,67.31 66.04,66.04 66.04,61.28 v65.72,60.83 | v59.4,60.77 59.05,57.15 58.42,56.52 58.42,53.02 CTRL_BUS.2
/MEMWRITE  (via drill 0.6)
  Top 0.305: CTRL_BUS.4 CTRL_BUS.3 57.15,46.04 v61.28,41.91 | v63.18,41.91 66.67,38.42 66.67,35.24 70.48,31.43 70.48,27.62 v70.8,27.3 | v58.42,18.41 RAM-CS0.29 | CART-CS1.PQ 80.3,8.91 81.6,7.62 83.5,7.62 84.45,8.57 84.45,10.16 81.6,13.02 75.56,13.02 74.3,14.29 v71.44,14.92 | v67.63,14.29 67.63,15.56 65.41,17.78 65.41,18.1 v66.36,19.05
  Bottom 0.305: CTRL_BUS.4 57.15,50.48 59.69,53.02 IC2.3 60.96,56.39 60.96,68.9 59.69,70.17 IC1.3 | v61.28,41.91 v63.18,41.91 | v70.8,27.3 70.8,25.08 65.72,20 | 65.72,20 64.77,19.05 59.05,19.05 v58.42,18.41 | v71.44,14.92 v67.63,14.29 | v66.36,19.05 66.04,19.68 65.72,20
/MREQ
  Top 0.305: CTRL_BUS.11 CTRL_BUS.12 | EZ80F93.46 44.64,62.42 46.04,63.82 46.04,65.41 47.62,66.99 49.53,66.99 52.07,69.53 55.88,69.53 57.15,70.8 IC1.2 57.15,73.34 57.47,73.66 61.28,73.66 62.23,72.71 IC1.4
  Bottom 0.305: IC1.4 62.23,65.72 63.5,64.45 63.5,53.66 64.45,52.7 66.36,52.7 67.31,51.75 CTRL_BUS.12
/RD  (via drill 0.6)
  Top 0.305: EZ80F93.47 44.19,62.92 45.4,64.14 45.4,65.72 47.31,67.63 48.58,67.63 v49.85,68.9 | v56.83,68.9 64.14,68.9 64.77,69.53 IC1.5
  Bottom 0.305: v49.85,68.9 v56.83,68.9
/WR
  Top 0.305: EZ80F93.48 43.73,63.42 44.77,64.45 44.77,66.04 49.21,70.48 53.34,70.48 IC1.1
A0  (via drill 0.6)
  Top 0.305: EZ80F93.1 23.18,48.58 21.59,46.35 21.62,44.42 21.59,36.2 22.86,34.92 ADDRESS_BUS.1 | v66.04,43.5 71.75,43.5 | 71.75,43.5 73.98,43.5 v74.93,44.45 | CART-CS1.PL 58.88,10.3 v61.28,12.7 | v72.71,17.78 72.71,42.55 71.75,43.5
  Bottom 0.305: RAM-CS0.12 ADDRESS_BUS.1 38.1,35.24 36.83,36.51 36.83,40.64 39.69,43.5 v66.04,43.5 | v74.93,44.45 74.93,61.28 75.56,61.91 77.15,61.91 AY-3-8912-CS2.20 | v61.28,12.7 71.12,12.7 72.71,14.29 v72.71,17.78
A1  (via drill 0.6)
  Top 0.305: EZ80F93.2 23.7,48.02 22.49,46.25 22.44,36.3 23.18,35.56 36.2,35.56 ADDRESS_BUS.2 | RAM-CS0.11 40.64,23.5 v42.23,21.91 | v52.07,18.41 52.07,9.53 52.7,8.89 54.89,8.89 CART-CS1.PK
  Bottom 0.305: v42.23,21.91 49.85,21.91 50.48,21.27 50.48,20 v52.07,18.41 | RAM-CS0.11 40.64,31.43 39.37,32.7 39.37,36.2 ADDRESS_BUS.2
A2  (via drill 0.6)
  Top 0.305: EZ80F93.3 24.23,47.42 23.18,45.94 23.26,37.7 v24.45,36.83 | v24.45,33.34 39.05,33.34 | 39.05,33.34 ADDRESS_BUS.3 | 39.05,33.34 40.32,32.23 42.01,31.18 42.7,30.48 RAM-CS0.10 v43.18,20.32 | v50.8,13.65 50.8,12.38 CART-CS1.PJ
  Bottom 0.305: v24.45,36.83 v24.45,33.34 | v43.18,20.32 44.13,17.46 45.72,17.14 46.99,16.19 46.99,14.29 47.31,13.65 v50.8,13.65
A3  (via drill 0.6)
  Top 0.254: 40.64,36.83 41.91,35.34
  Top 0.305: EZ80F93.4 24.71,46.3 23.81,45.4 23.81,40.96 26.04,38.73 26.04,37.15 26.67,36.51 35.88,36.51 36.51,37.15 36.51,37.78 37.47,38.73 39.37,38.73 ADDRESS_BUS.4 40.64,36.83 | 41.91,35.34 41.91,34.29 40.99,33.05 40.99,32.45 41.05,32.38 42.48,31.66 44.7,31.66 RAM-CS0.9 v45.72,26.99 | v39.37,26.99 39.37,18.73 v40.64,17.46 | v45.72,12.38 45.72,10.19 CART-CS1.PI
  Bottom 0.305: v45.72,26.99 v39.37,26.99 | v40.64,17.46 41.27,17.46 41.91,16.83 41.91,13.97 43.18,12.7 45.4,12.7 v45.72,12.38
A4  (via drill 0.6)
  Top 0.305: EZ80F93.5 25.21,44.59 26.11,43.69 26.8,42.74 26.67,40.64 28.57,39.05 35.88,39.05 | 35.88,39.05 36.2,39.37 40.64,39.37 41.91,38.1 41.91,36.2 ADDRESS_BUS.5 | RAM-CS0.8 48.26,30.7 47.4,31.84 v46.9,32 | 35.88,39.05 v35.56,37.78 | v36.83,32.38 v36.83,18.1 | v44.13,11.43 44.13,10.02 CART-CS1.PH
  Bottom 0.254: 44.64,33.5 43.94,34.2
  Bottom 0.305: v46.9,32 45.34,31.69 44.61,32.42 44.64,33.5 | 43.94,34.2 43.91,34.2 ADDRESS_BUS.5 | v35.56,37.78 35.88,33.34 v36.83,32.38 | v36.83,18.1 36.83,14.29 37.78,13.34 38.1,13.34 40.01,11.43 v44.13,11.43
A5  (via drill 0.6)
  Top 0.254: 45.62,32.13 46.48,32.86
  Top 0.305: EZ80F93.6 25.71,45.09 26.61,44.2 28.89,44.2 30.16,42.86 30.16,40.32 | 30.16,40.32 30.16,40.07 30.48,39.75 35.56,39.69 36.2,39.94 36.58,39.94 37.15,40.01 40.96,40.01 41.91,39.05 42.55,39.05 42.86,38.73 42.86,37.78 ADDRESS_BUS.6 | v42.16,33.02 42.7,32.48 43.47,32.13 45.62,32.13 | 46.48,32.86 49.78,32.77 RAM-CS0.7 | 30.16,40.32 v29.21,40.32 | v29.21,32.38 29.21,11.11 30.16,10.48 v34.92,10.79
  Bottom 0.305: ADDRESS_BUS.6 41.91,36.2 41.94,33.59 v42.16,33.02 | v29.21,40.32 v29.21,32.38 | v34.92,10.79 38.1,10.16 CART-CS1.PG
A6  (via drill 0.6)
  Top 0.305: EZ80F93.9 27.21,46.77 30.73,43.12 30.8,40.96 30.8,40.7 31.11,40.39 35.81,40.39 35.94,40.51 38.1,40.64 42.23,40.64 44.45,38.42 44.45,36.2 ADDRESS_BUS.7 v43.81,33.02 | v44.77,28.57 44.77,23.5 | 44.77,23.5 44.77,20.32 41.91,17.78 41.91,13.02 41.27,12.38 38.57,12.38 CART-CS1.PF | RAM-CS0.6 53.34,27.3 v49.53,23.5 | v46.04,23.5 44.77,23.5
  Bottom 0.305: v43.81,33.02 43.81,32.38 44.45,31.75 44.45,28.89 v44.77,28.57 | v49.53,23.5 v46.04,23.5
A7  (via drill 0.6)
  Top 0.254: 45.91,33.27 46.39,33.4 54.32,33.27 | 67.63,3.49 66.04,3.37 37.12,3.33 35.66,1.36 31.21,1.36 29.53,3.49
  Top 0.305: EZ80F93.10 27.71,47.22 31.43,43.5 31.37,41.34 31.37,41.27 31.75,40.89 35.43,40.89 35.69,41.15 38.42,41.27 42.55,41.27 45.72,38.1 ADDRESS_BUS.8 | v45.4,33.18 45.91,33.27 | 54.32,33.27 54.36,33.24 54.61,33.02 55.88,31.75 RAM-CS0.5 v55.88,23.81 | v66.99,17.78 68.58,15.24 68.58,5.08 68.26,4.13 67.63,3.49 | 29.53,3.49 29.53,7.3 CART-CS1.PE
  Bottom 0.305: ADDRESS_BUS.8 45.72,37.15 44.45,35.88 44.45,34.7 45.24,33.75 v45.4,33.18 | v55.88,23.81 55.56,22.23 57.47,17.14 v66.99,17.78
A8  (via drill 0.6)  (1 unrouted)
  Top 0.305: EZ80F93.11 28.21,47.67 32,43.75 32.07,42.1 32.64,41.53 35.43,41.53 35.56,41.66 38.73,41.91 42.86,41.91 45.72,39.05 46.35,39.05 46.99,38.42 46.99,36.2 ADDRESS_BUS.9 | v48.58,32 49.21,31.75 49.53,31.43 v49.53,26.35 | v53.34,19.37 RAM-CS0.27
  Bottom 0.305: ADDRESS_BUS.9 v48.58,32 | v49.53,26.35 50.8,23.5 v53.34,19.37
A9  (via drill 0.6)  (1 unrouted)
  Top 0.305: EZ80F93.12 28.71,47.87 32.58,44.01 32.64,42.99 33.15,42.29 33.4,42.04 35.18,42.04 35.43,42.29 39.05,42.55 43.18,42.55 46.04,39.69 47.31,39.69 47.94,39.05 47.94,37.78 ADDRESS_BUS.10 | v46.99,28.26 46.99,27.94 48.58,26.35 48.58,25.4 47.62,24.45 47.62,17.46 v47.94,17.14
  Bottom 0.254: 47.72,32.67 47.72,31.5 46.96,30.86
  Bottom 0.305: ADDRESS_BUS.10 46.99,36.2 47.05,33.59 47.47,33.27 47.72,32.67 | 46.96,30.86 v46.99,28.26 | v47.94,17.14 50.48,17.14 50.8,16.83 RAM-CS0.26
A10  (via drill 0.6)  (1 unrouted)
  Top 0.305: EZ80F93.13 29.21,48.07 33.15,44.26 33.85,42.86 39.37,43.18 43.5,43.18 46.35,40.32 47.94,40.32 49.53,38.73 49.53,36.2 ADDRESS_BUS.11 | v53.02,32.07 52.7,32.07 52.07,31.43 52.07,26.99 48.58,24.13 v48.58,20.32 | v45.72,20.32 43.18,17.78 RAM-CS0.23
  Bottom 0.305: ADDRESS_BUS.11 50.8,34.29 v53.02,32.07 | v48.58,20.32 v45.72,20.32
A11  (via drill 0.6)  (1 unrouted)
  Top 0.305: EZ80F93.14 29.71,48.27 33.59,44.51 34.16,43.37 39.69,43.81 43.81,43.81 46.67,40.96 48.58,40.96 50.8,38.73 ADDRESS_BUS.12 | v46.99,26.04 46.99,16.51 RAM-CS0.25
  Bottom 0.254: 49.31,35.78 49.31,33.78
  Bottom 0.305: ADDRESS_BUS.12 50.16,37.47 49.31,36.61 49.31,35.78 | 49.31,33.78 49.66,28.42 v46.99,26.04
A12  (1 unrouted)
  Top 0.305: EZ80F93.15 30.21,48.47 34.04,44.77 34.48,44.01 40.01,44.45 44.13,44.45 46.99,41.59 48.9,41.59 52.07,38.42 52.07,36.2 ADDRESS_BUS.13
  Bottom 0.305: ADDRESS_BUS.13 53.98,34.92 RAM-CS0.4
A13  (1 unrouted)
  Top 0.305: EZ80F93.16 30.71,48.79 34.48,45.02 34.8,44.51 40.32,45.09 44.45,45.09 47.31,42.23 49.21,42.23 52.7,38.73 52.7,38.1 ADDRESS_BUS.14
  Bottom 0.254: 50.16,36.2 49.72,35.56 49.72,33.97 51.12,32.38
  Bottom 0.305: ADDRESS_BUS.14 52.7,37.47 51.44,36.2 50.16,36.2 | 51.12,32.38 51.75,32.38 52.07,32.07 52.07,23.18 54.61,20.32 55.56,18.41 55.88,18.1 RAM-CS0.28
A14  (via drill 0.6)
  Top 0.305: EZ80F93.17 31.21,50.39 31.24,48.96 35.12,45.15 40.64,45.72 44.77,45.72 47.62,42.86 49.53,42.86 53.34,39.05 53.66,39.05 54.61,38.1 54.61,36.2 ADDRESS_BUS.15 | v58.1,32.38 60.01,32.38 60.96,31.43 RAM-CS0.3 60.96,26.99 v58.74,26.04 | v53.66,25.08 53.66,22.86 v48.9,18.73 | v45.72,18.41 44.45,16.83 44.45,13.34 42.86,11.75 38.73,11.75 37.15,10.16 37.15,7.94 36.2,6.99 32.99,6.99 CART-CS1.P5
  Bottom 0.305: v58.1,32.38 58.1,32.7 ADDRESS_BUS.15 | v58.74,26.04 54.61,26.04 v53.66,25.08 | v48.9,18.73 v45.72,18.41
A15  (1 unrouted)
  Top 0.305: EZ80F93.20 32.71,48.32 34.54,46.48 44.83,46.48 47.88,43.43 49.91,43.43 53.72,39.62 54.99,39.62 56.01,38.61 56.01,37.59 ADDRESS_BUS.16 55.88,36.83 57.15,35.56 57.15,23.5 58.1,22.54 62.55,22.54 63.5,21.59 RAM-CS0.31
A16  (via drill 0.6)
  Top 0.305: EZ80F93.21 33.21,48.58 34.8,46.99 45.09,46.99 48.13,43.94 50.16,43.94 53.98,40.13 55.75,40.13 57.15,38.73 57.15,36.51 57.78,36.2 58.42,35.56 ADDRESS_BUS.17 62.87,30.48 RAM-CS0.2 63.5,27.62 61.91,26.04 v61.91,23.5 | v59.69,20.95 59.69,12.38 57.78,10.48 56.52,10.48 56.52,8.26 55.56,7.3 41.24,7.3 CART-CS1.P7
  Bottom 0.305: v61.91,23.5 61.91,23.18 v59.69,20.95
A17  (via drill 0.6)
  Top 0.305: EZ80F93.22 33.71,48.84 35.05,47.5 45.47,47.5 48.39,44.58 50.42,44.58 54.23,40.77 56.39,40.77 58.42,38.73 ADDRESS_BUS.18 | v54.61,28.26 54.61,22.86 49.53,17.78 v49.53,8.26
  Bottom 0.305: ADDRESS_BUS.18 58.42,37.15 57.47,36.2 52.7,36.2 52.07,35.56 52.07,33.97 53.98,32.7 53.98,32.38 54.61,31.75 v54.61,28.26 | v49.53,8.26 47.94,6.67 44.45,6.67 42.95,5.17 CART-CS1.P8
A18  (via drill 0.6)
  Top 0.305: EZ80F93.23 34.21,49.23 35.31,48.13 45.72,48.13 48.64,45.21 50.67,45.21 54.48,41.4 56.77,41.4 59.69,38.48 59.69,36.2 ADDRESS_BUS.19 | v58.42,21.59 58.42,21.27 57.15,20 v57.15,12.06 | v57.47,9.53 57.47,7.3 56.83,6.67 48.53,6.67 CART-CS1.P9
  Bottom 0.305: ADDRESS_BUS.19 60.96,33.02 62.23,31.75 62.23,25.72 61.28,24.77 61.28,24.45 v58.42,21.59 | v57.15,12.06 57.15,9.84 v57.47,9.53
A19  (via drill 0.6)
  Top 0.305: EZ80F93.24 34.71,49.49 35.56,48.64 45.97,48.64 48.9,45.72 50.93,45.72 54.74,41.91 57.53,41.91 60.96,38.48 ADDRESS_BUS.20 | v56.83,22.23 56.83,21.91 54.61,19.68 54.61,12.06 v53.02,10.48
  Bottom 0.305: ADDRESS_BUS.20 59.69,36.2 59.69,24.45 59.05,23.81 58.42,23.81 v56.83,22.23 | v53.02,10.48 53.02,5.71 52.39,5.08 50.9,5.08 CART-CS1.P10
A20  (via drill 0.6)
  Top 0.305: EZ80F93.25 35.21,49.75 35.81,49.15 46.23,49.15 49.15,46.23 51.18,46.23 54.86,42.55 57.78,42.55 62.23,38.1 62.23,36.2 ADDRESS_BUS.21 63.5,33.34 64.77,32.07 64.77,27.94 63.82,26.99 63.82,23.81 v63.5,23.5 | v62.23,20.95 62.23,11.11 60.96,9.84 60.96,7.62 60.64,7.3 59.05,7.3 56.83,5.08 54.86,5.08 CART-CS1.P11
  Bottom 0.305: v63.5,23.5 63.5,23.18 v62.23,20.95
A21
  Top 0.305: EZ80F93.26 38.07,52.42 40.64,49.85 46.35,49.85 49.21,46.99 51.44,46.99 55.24,43.18 58.42,43.18 63.5,38.1 ADDRESS_BUS.22 63.5,37.15 65.09,35.56 65.09,33.02 65.72,32.38 66.99,32.38 68.58,30.8 68.58,26.99 64.14,22.54 64.14,16.51 64.77,15.88 64.77,8.26 63.18,6.67 59.37,6.67 58.74,6.03 58.74,5.12 CART-CS1.P12
D0  (via drill 0.6)  (1 unrouted)
  Top 0.305: AY-3-8912-CS2.28 DATA_BUS.1 77.47,33.97 73.66,30.16 v73.66,21.59 | v68.58,17.78 v70.17,11.11
  Top 0.406: RAM-CS0.13 35.56,17.46 36.83,16.19 v36.83,12.38
  Bottom 0.305: 50.8,12.06 51.75,12.38 54.61,12.38 | v73.66,21.59 69.85,17.78 v68.58,17.78 | v70.17,11.11 69.53,10.48 63.5,10.48
  Bottom 0.406: v36.83,12.38 37.47,12.38 39.37,10.48 48.26,10.48 49.53,11.75 49.53,12.06 50.8,12.06 | 54.61,12.38 55.88,13.34 57.78,13.34 59.37,11.75 62.87,11.75 63.5,10.79 63.5,10.48 63.5,9.58 CART-CS1.PM
D1  (via drill 0.6)  (1 unrouted)
  Top 0.254: 36.83,3.81 63.5,3.81 64.07,4.45 64.07,6.18
  Top 0.305: AY-3-8912-CS2.27 79.06,44.45 80.01,43.5 DATA_BUS.2 80.01,35.24 74.61,29.84 v74.61,23.5
  Top 0.406: RAM-CS0.14 33.02,18.1 34.29,16.83 34.29,13.34 v34.92,12.38 | v34.61,3.17 36.2,3.17 36.83,3.81 | 64.07,6.18 CART-CS1.PN
  Bottom 0.305: v74.61,23.5 74.61,11.43 73.34,10.16 73.34,9.21 71.12,6.99 68.73,6.99 CART-CS1.PN
  Bottom 0.406: v34.92,12.38 33.02,11.43 33.02,4.76 v34.61,3.17
D2  (via drill 0.6)  (1 unrouted)
  Top 0.305: EZ80F93.37 48.12,57.92 v53.02,53.02 | v56.2,53.02 60.45,52.8 62.99,51.15 73.03,51.12 74.61,49.53 74.61,47.62 75.25,46.99 AY-3-8912-CS2.26 81.28,46.99 82.55,45.72 DATA_BUS.3 82.55,30.48 83.5,29.53 v83.5,22.86 | v78.74,11.11 72.71,10.79 72.71,10.86 CART-CS1.PO
  Bottom 0.305: v53.02,53.02 v56.2,53.02 | v83.5,22.86 83.5,20.64 83.19,20.32 83.19,13.97 v78.74,11.11
D3  (via drill 0.6)  (1 unrouted)
  Top 0.254: 49.59,57.59 70.71,57.56
  Top 0.305: EZ80F93.38 48.58,58.42 49.59,57.59 | 70.71,57.56 72.71,55.56 72.71,52.39 75.56,49.53 AY-3-8912-CS2.25 82.55,49.53 85.09,46.99 DATA_BUS.4 v85.09,22.86
  Bottom 0.305: v85.09,22.86 85.09,11.11 84.45,10.48 76.29,10.16 CART-CS1.PP
D4  (via drill 0.6)  (1 unrouted)
  Top 0.305: EZ80F93.39 49.03,58.92 49.85,58.1 71.12,58.1 73.34,55.88 73.34,53.34 74.61,52.07 AY-3-8912-CS2.24 80.96,52.07 87.31,45.72 87.31,35.88 DATA_BUS.5 | v87.63,32.7 85.72,30.8 85.72,24.45 86.68,23.5 v86.68,22.86
  Bottom 0.305: DATA_BUS.5 v87.63,32.7 | v86.68,22.86 86.68,10.16 83.82,7.3 75.88,7.3 74.65,6.07 CART-CS1.P16
D5  (via drill 0.6)  (1 unrouted)
  Top 0.305: EZ80F93.40 49.48,59.42 50.16,58.74 71.44,58.74 74.3,55.88 74.3,54.93 74.61,54.61 AY-3-8912-CS2.23 79.69,54.61 88.9,45.4 88.9,40.01 89.85,39.05 89.85,35.88 DATA_BUS.6 88.9,34.29 v88.9,21.59
  Bottom 0.305: v88.9,21.59 88.9,9.84 85.72,6.67 77.15,6.67 76.52,6.03 76.52,4.13 75.56,3.49 71.12,3.49 70.69,3.92 CART-CS1.P15
D6  (via drill 0.6)  (1 unrouted)
  Top 0.305: EZ80F93.41 49.94,59.92 50.48,59.37 71.75,59.37 73.98,57.15 AY-3-8912-CS2.22 80.33,57.15 82.87,54.61 82.87,52.39 89.53,45.72 89.53,41.27 92.71,38.1 DATA_BUS.7 91.44,34.29 91.44,24.77 90.17,23.5 v90.17,22.86 | v86.68,6.03 84.45,6.99 v73.34,6.99
  Bottom 0.305: v90.17,22.86 90.17,8.26 87.95,6.03 v86.68,6.03 | v73.34,6.99 72.71,6.35 67.63,6.35 66.73,5.45 CART-CS1.P14
D7  (via drill 0.6)  (1 unrouted)
  Top 0.254: 50.77,59.94 72.36,59.94
  Top 0.305: EZ80F93.42 50.39,60.42 50.77,59.94 | 72.36,59.94 72.71,59.69 AY-3-8912-CS2.21 80.01,59.69 83.5,56.2 83.5,52.7 90.49,45.72 94.61,45.72 96.84,43.5 96.84,37.15 DATA_BUS.8 96.84,33.97 96.84,23.18 94.93,21.27 v94.93,19.05 | v85.72,3.49 v69.53,3.49
  Bottom 0.305: v94.93,19.05 94.93,6.03 93.98,4.45 87,4.45 86.04,3.49 v85.72,3.49 | v69.53,3.49 64.33,3.49 CART-CS1.P13
GND  (via drill 0.6)
  Top 0.305: EZ80F93.44 46.18,61.42 C6.2 | EZ80F93.97 24.18,53.92 v24.45,53.66 | EZ80F93.8 26.71,52.43 v26.99,52.7 | EZ80F93.19 32.21,51.9 v33.34,53.02 | EZ80F93.34 33.24,56.42 v33.02,56.2 | EZ80F93.57 32.21,63.96 v31.75,63.5 | EZ80F93.61 30.21,63.87 v29.84,63.5 | EZ80F93.84 22.95,60.42 v23.5,60.96
  Bottom 0.305: v24.45,53.66 24.45,53.34 25.4,52.39 23.5,52.39 23.18,52.07 | v26.99,52.7 27.3,52.7 27.62,53.02 | v33.34,53.02 34.29,53.02 | v33.02,56.2 32.7,56.2 32.07,55.56 | v31.75,63.5 31.75,63.82 31.43,63.5 | v29.84,63.5 29.21,63.5 | v23.5,60.96 23.5,61.28 23.81,61.59
  pour Bottom: 0,99.06 0,0 99.06,0 99.06,99.06
HALT_SLP  (via drill 0.6)
  Top 0.305: EZ80F93.55 33.21,76.33 32.38,76.83 32.38,83.82 31.11,85.09 v31.11,87.63
  Bottom 0.305: v31.11,87.63 31.11,90.81 31.75,91.44 BOBMISC.2
N$1
  Top 0.305: R4.2 10.16,66.04 8.89,64.77 8.89,59.69 7.62,58.42 6.35,58.42 Z-OSC.2 7.94,54.29 C3.1 4.13,44.45 R2.2
N$2  (1 unrouted)
N$8
  Bottom 0.305: AY-3-8912-CS2.4 91.44,49.53 88.9,46.99 88.9,32.7 90.17,30.8 SPKR.2
N$9
  Bottom 0.305: SPKR.3 92.71,31.43 91.44,32.7 91.44,40.64 AY-3-8912-CS2.1
N$10
  Bottom 0.305: AY-3-8912-CS2.5 90.81,52.07 86.36,47.31 86.36,29.53 SPKR.1
N$11
  Top 0.305: OSCDIL14.8 AY-3-8912-CS2.15
NMI  (via drill 0.6)
  Top 0.305: EZ80F93.52 34.71,69.38 | 34.71,69.38 34.71,77.57 34.92,77.79 34.92,82.55 32.7,84.77 32.7,89.66 29.21,91.5 BOBMISC.1 | 34.71,69.38 35.18,69.85 39.69,69.85 40.32,70.48 47.31,70.48 52.39,75.56 59.69,75.56 60.01,75.88 v60.96,75.88 | R12.2 71.75,72.71 70.48,73.98 v64.45,73.98
  Bottom 0.305: v60.96,75.88 62.55,73.98 v64.45,73.98
NRST
  Top 0.305: EZ80F93.51 35.21,66.9 35.88,67.69 38.73,67.69 40.64,69.85 47.62,69.85 52.7,74.93 61.59,74.93 63.5,77.47 63.5,84.66 | 63.5,84.66 S1.3 | 63.5,84.66 63.5,85.41 64.45,86.36 73.66,86.36 76.2,88.9 R3.1
PB0
  Top 0.305: EZ80F93.88 15.88,58.42 14.29,56.83 14.29,51.44 13.34,50.48 11.11,50.48 9.84,49.21 9.84,47.94 8.57,46.67 7.3,46.67 1.27,40.64 BOBGPIOB.1
PB1
  Top 0.305: EZ80F93.89 16.33,57.92 14.92,56.52 14.92,51.12 13.65,49.85 11.43,49.85 10.48,48.9 10.48,47.62 8.89,46.04 7.94,46.04 3.81,41.91 BOBGPIOB.2
PB2
  Top 0.305: EZ80F93.90 16.78,57.42 15.56,56.2 15.56,50.8 13.97,49.21 11.75,49.21 11.11,48.58 11.11,46.67 6.35,41.91 BOBGPIOB.3
PB3
  Top 0.305: EZ80F93.91 17.23,56.92 16.19,55.88 16.19,50.48 13.97,48.26 12.7,48.26 12.06,47.62 12.06,44.77 8.89,41.59 BOBGPIOB.4
PB4
  Top 0.305: EZ80F93.92 17.68,56.42 16.83,55.56 16.83,50.16 12.7,46.04 12.7,42.86 11.43,41.59 BOBGPIOB.5
PB5
  Top 0.305: EZ80F93.93 18.14,55.92 17.46,55.24 17.46,49.85 13.97,46.35 BOBGPIOB.6
PB6  (via drill 0.6)
  Top 0.305: EZ80F93.94 18.59,55.42 18.1,54.93 18.1,49.53 14.61,46.04 14.61,41.27 v14.92,40.96
  Bottom 0.305: v14.92,40.96 16.51,39.37 BOBGPIOB.7
PB7
  Top 0.305: EZ80F93.95 19.04,54.92 18.73,54.61 18.73,48.9 15.56,45.72 15.56,42.86 15.88,42.55 17.14,42.55 18.1,41.59 18.1,37.78 BOBGPIOB.8
PC0
  Top 0.305: EZ80F93.76 19.72,64.42 19.05,65.09 19.05,73.34 22.86,77.15 GPIOC-JOY0.1 23.81,80.01 26.67,82.87 R11.1
PC1
  Top 0.305: EZ80F93.77 18.95,63.92 18.1,64.77 18.1,75.25 20.32,77.47 GPIOC-JOY0.2 20.32,81.28 R10.1
PC2  (via drill 0.6)
  Top 0.305: EZ80F93.78 18.5,63.42 17.46,64.45 17.46,79.69 GPIOC-JOY0.3 17.78,80.96 v15.88,82.87
  Bottom 0.305: v15.88,82.87 14.92,83.82 14.92,87.31 R9.1
PC3  (via drill 0.6)
  Top 0.305: EZ80F93.79 18.04,62.92 16.83,64.14 16.83,75.25 15.24,76.83 GPIOC-JOY0.4 15.24,80.96 v13.34,82.87 | v7.3,82.87 R8.1
  Bottom 0.305: v7.3,82.87 v13.34,82.87
PC4
  Top 0.305: EZ80F93.80 17.59,62.42 16.19,63.82 16.19,73.66 12.7,77.15 GPIOC-JOY0.5 12.7,81.28 R7.1
PC5
  Top 0.305: EZ80F93.81 17.14,61.92 15.56,63.5 15.56,72.71 10.16,78.11 GPIOC-JOY0.6
PC6  (via drill 0.6)
  Top 0.305: EZ80F93.82 16.68,61.42 14.92,63.18 14.92,68.9 v12.38,71.44
  Bottom 0.305: v12.38,71.44 12.38,71.75 11.11,73.03 11.11,73.66 7.62,77.15 GPIOC-JOY0.7
PC7  (via drill 0.6)
  Top 0.305: EZ80F93.83 16.23,60.92 14.29,62.87 14.29,67.94 v10.48,71.75 | v7.62,74.61 5.08,77.15 GPIOC-JOY0.8
  Bottom 0.305: v10.48,71.75 v7.62,74.61
PD0  (via drill 0.6)  (1 unrouted)
  Top 0.254: GPIOD-JOY1.1 50.8,84.45 R23.1 | EZ80F93.68 26.7,68.33 26.51,68.52 v26.51,68.96
  Bottom 0.254: v26.51,68.96 27.72,69.98 30.1,69.98 32.29,71.37 35.02,71.37 35.66,70.74 v35.66,68.58
PD1  (via drill 0.6)
  Top 0.254: GPIOD-JOY1.2 43.81,82.04 44.32,82.55 48.16,82.55 48.74,83.12 v48.77,86.49 | EZ80F93.69 26.23,66.03 26.19,67.98 24.73,69.44 v25.81,70.04
  Bottom 0.254: v48.77,86.49 50.7,88.9 R22.1 | v25.81,70.04 27.27,70.39 29.56,70.42 32.1,71.94 37.94,71.94 43.81,77.82 GPIOD-JOY1.2
PD2  (via drill 0.6)
  Top 0.254: EZ80F93.70 25.72,67.72 25.56,67.98 24.7,68.74 23.46,69.44 v24.51,70.52
  Bottom 0.254: v24.51,70.52 25.72,70.9 29.53,70.9 31.75,72.36 37.66,72.36 41.27,75.98 GPIOD-JOY1.3
  Bottom 0.305: GPIOD-JOY1.3 41.27,87 R21.1
PD3  (via drill 0.6)
  Top 0.254: EZ80F93.71 25.21,67.72 24.61,68.23 22.8,69.28 v23.37,70.77
  Top 0.305: v30.67,92.01 33.59,92.01 35.94,89.66 35.94,86.36 v35.88,86.3
  Bottom 0.254: v23.37,70.77 23.94,71.31 29.15,71.31 31.59,72.83 37.53,72.83 38.77,74.07 38.77,74.68 38.73,74.71 GPIOD-JOY1.4
  Bottom 0.305: R20.1 27.4,88.9 v30.67,92.01 | v35.88,86.3 35.88,82.64 36.45,82.07 38.42,82.07 38.77,81.72 38.77,80.04 GPIOD-JOY1.4
PD4  (via drill 0.6)
  Top 0.254: EZ80F93.72 24.67,67.6 23.56,68.33 22.26,69.09 22.1,69.18 v22.13,70.55
  Top 0.305: R14.1 46.99,84.14 46.35,83.5 43.81,83.5 42.61,82.49 v40.48,82.49 | v36.7,83.22 36.2,82.33 GPIOD-JOY1.5
  Bottom 0.254: v22.13,70.55 22.83,71.63 23.24,71.75 28.83,71.75 30.16,72.8 30.16,76.99 30.64,77.47 35.12,77.47 36.2,78.55 GPIOD-JOY1.5
  Bottom 0.305: v40.48,82.49 39.88,82.49 39.05,82.96 v36.7,83.22
PD5  (via drill 0.6)
  Top 0.254: EZ80F93.73 24.19,66.04 24.19,67.37 20.51,69.53 20.51,70.61 20.92,71.03 21.21,71.03 21.81,71.6 v21.81,71.91
  Bottom 0.254: v21.81,71.91 22.51,71.98 22.83,72.2 28.45,72.17 29.69,73.18 29.65,77.66 30.04,78.04 32.92,78.04 33.66,78.77 GPIOD-JOY1.6
PD6  (via drill 0.6)  (1 unrouted)
  Top 0.254: EZ80F93.74 23.72,67.15 20.03,69.22 20.03,71.5 20.48,71.94 v20.51,71.94
  Bottom 0.254: v20.51,71.94 21.24,72.68 28.19,72.64 29.18,73.69 29.18,77.88 31.11,79.82 GPIOD-JOY1.7
PD7  (via drill 0.6)  (1 unrouted)
  Top 0.254: EZ80F93.75 23.21,66.96 19.59,68.9 19.59,72.33 20.38,73.12 v20.38,73.18
  Bottom 0.254: v20.38,73.18 20.92,73.15 28,73.09 28.57,73.75 GPIOD-JOY1.8
PHI
  Top 0.305: EZ80F93.100 21.58,52.39 20.95,52.39 20.64,52.07 20.64,46.35 19.81,45.53 PHI.1
RTC_VDD  (via drill 0.6)
  Top 0.305: EZ80F93.60 30.71,69.13 31.43,69.85 31.43,72.07 29.84,73.66 29.84,87.95 30.48,88.9 v31.88,88.9
  Bottom 0.305: v31.88,88.9 32.07,89.22 32.07,90.49 32.7,91.12 40.96,91.12 41.91,92.08 BOBMISC.6
RTC_XIN  (via drill 0.6)
  Top 0.305: EZ80F93.58 31.71,68.22 32.7,69.22 32.7,74.93 v32.07,75.56 | v35.88,75.56 35.88,76.2 37.47,77.79 v37.47,84.33 | BOBMISC.8 46.99,91.76 43.18,87 37.47,87 v37.47,86.36
  Bottom 0.305: v32.07,75.56 v35.88,75.56 | v37.47,84.33 v37.47,86.36
RTC_XOUT  (via drill 0.6)
  Top 0.305: EZ80F93.59 31.21,68.67 32.07,69.53 32.07,73.34 v31.43,73.98 | v36.83,73.98 36.83,74.93 40.01,78.11 40.01,81.57 39.05,82.36 39.4,83.85 v42.23,84.14
  Bottom 0.305: v31.43,73.98 v36.83,73.98 | v42.23,84.14 42.23,89.53 44.45,91.76 BOBMISC.7
SCL
  Top 0.305: EZ80F93.99 20.54,52.92 20,52.39 20,48.26 17.14,45.4 17.14,44.45 20,41.91 20.64,41.27 20.64,33.34 BOBI2C.1
SDA  (via drill 0.6)
  Top 0.305: EZ80F93.98 20.08,53.42 19.37,52.7 19.37,48.58 16.19,45.4 16.19,44.13 17.14,43.5 18.73,41.91 v19.05,40.01
  Bottom 0.305: v19.05,40.01 17.78,38.42 17.78,33.66 BOBI2C.2
TCK_ZCL  (via drill 0.6)
  Top 0.254: EZ80F93.63 29.21,69.25 30.23,70.26 30.23,71.53 28.57,73.03 | 53.78,92.27 72.64,92.27
  Top 0.305: 28.57,73.03 28.57,76.77 v27.3,77.47 | v27.94,83.19 28.89,84.14 28.89,89.22 25.4,92.71 24.13,92.71 BOBJTAG+.1 24.92,96.14 48.45,96.14 R1.2 53.78,92.27 | 72.64,92.27 v72.83,92.08
  Bottom 0.305: v27.3,77.47 27.3,82.55 v27.94,83.19 | v72.83,92.08 73.44,92.68 76.8,92.68 77.47,93.34 ISPZDI.4
TDI_ZDA  (via drill 0.6)
  Top 0.254: EZ80F93.65 28.23,69.56 29.23,70.56 29.23,71.14 27.65,72.55 27.62,75.69 26.92,75.95 26.35,76.14 25.97,76.9 25.69,77.53 v24.86,77.6 | v21.59,77.85 21.59,82.11 18.22,85.47 18.22,86.01 v18.07,86.17
  Top 0.305: R6.2 64.77,92.71 71.72,92.71 72.17,93.15 73.37,93.15 73.37,92.93 73.63,92.68 78.74,92.71 ISPZDI.6 | v62.83,96.65 18.57,96.61 17.78,95.89 BOBJTAG+.3
  Bottom 0.254: v24.86,77.6 23.56,77.72 v21.59,77.85 | v18.07,86.17 18.07,93.69 BOBJTAG+.3
  Bottom 0.305: R6.2 63.5,96.2 v62.83,96.65
TDO  (via drill 0.6)
  Top 0.254: EZ80F93.66 27.78,69.72 28.66,70.6 28.66,70.97 27.08,72.42 27.08,75.09 26.7,75.47 25.69,75.95 25.69,76.14 25.34,76.49 v23.62,76.36 | v18.95,77.72 19.02,81.44 16.57,83.88 15.75,83.88 13.97,85.66 13.97,86.52 v13.75,86.74
  Bottom 0.254: v23.62,76.36 21.27,76.83 v18.95,77.72 | v13.75,86.74 13.75,87.88 15.21,89.34 15.21,93.95 BOBJTAG+.4
TMS  (via drill 0.6)
  Top 0.254: 29.15,77.22 v26.35,79.38
  Top 0.305: EZ80F93.62 29.71,69.08 30.8,70.17 30.8,71.75 29.21,73.34 29.15,77.22 | v25.4,83.19 25.4,90.49 24.77,91.12 21.27,91.12 20.32,92.08 BOBJTAG+.2
  Bottom 0.305: v26.35,79.38 26.35,82.23 v25.4,83.19
TRIGOUT  (via drill 0.6)
  Top 0.254: EZ80F93.64 28.7,69.37 29.62,70.29 29.72,70.48 29.73,70.49 29.73,71.33 28.1,72.8 28.13,75.98 27.5,76.58 26.64,76.58 26.32,77.79 25.91,78.3 25.21,78.45 25.02,78.68 v25.02,79.57 | v24.29,82.04 23.5,82.04 v19.59,85.95 | v19.49,88.27 19.49,88.96 17.43,91.03 13.62,91.03 12.76,91.89 12.76,93.92 BOBJTAG+.5
  Bottom 0.254: v25.02,79.57 25.02,81.31 v24.29,82.04 | v19.59,85.95 19.59,88.17 v19.49,88.27
VCC
  Top 0.254: 96.49,0.45 3.46,0.45
  Top 0.305: PWROUT1.1 96.2,15.24 97.16,14.29 97.16,1.91 96.49,0.45 | 3.46,0.45 1.59,2.54 1.59,13.65 3.17,15.24 PWRIN1.1
XIN  (via drill 0.6)
  Top 0.305: Z-OSC.1 6.35,64.77 7.62,66.04 7.62,66.67 | 7.62,66.67 C1.1 7.62,72.39 8.89,73.66 R4.1 | EZ80F93.85 16.28,59.92 v12.7,63.5 | v9.21,66.67 7.62,66.67
  Bottom 0.305: v12.7,63.5 12.38,63.5 v9.21,66.67
XOUT  (via drill 0.6)
  Top 0.305: R2.1 2.22,56.52 v5.08,59.37 | EZ80F93.86 10.21,59.42 v10.16,59.37
  Bottom 0.305: v5.08,59.37 v10.16,59.37

### Text on the board
tPlace: Zikzak / www.zikzak.ca / Jeff Mitchell / Base rev 1 06-2014